# EAGLE design project (EAGLE 9.7.0)

## Sheet 1 of 2
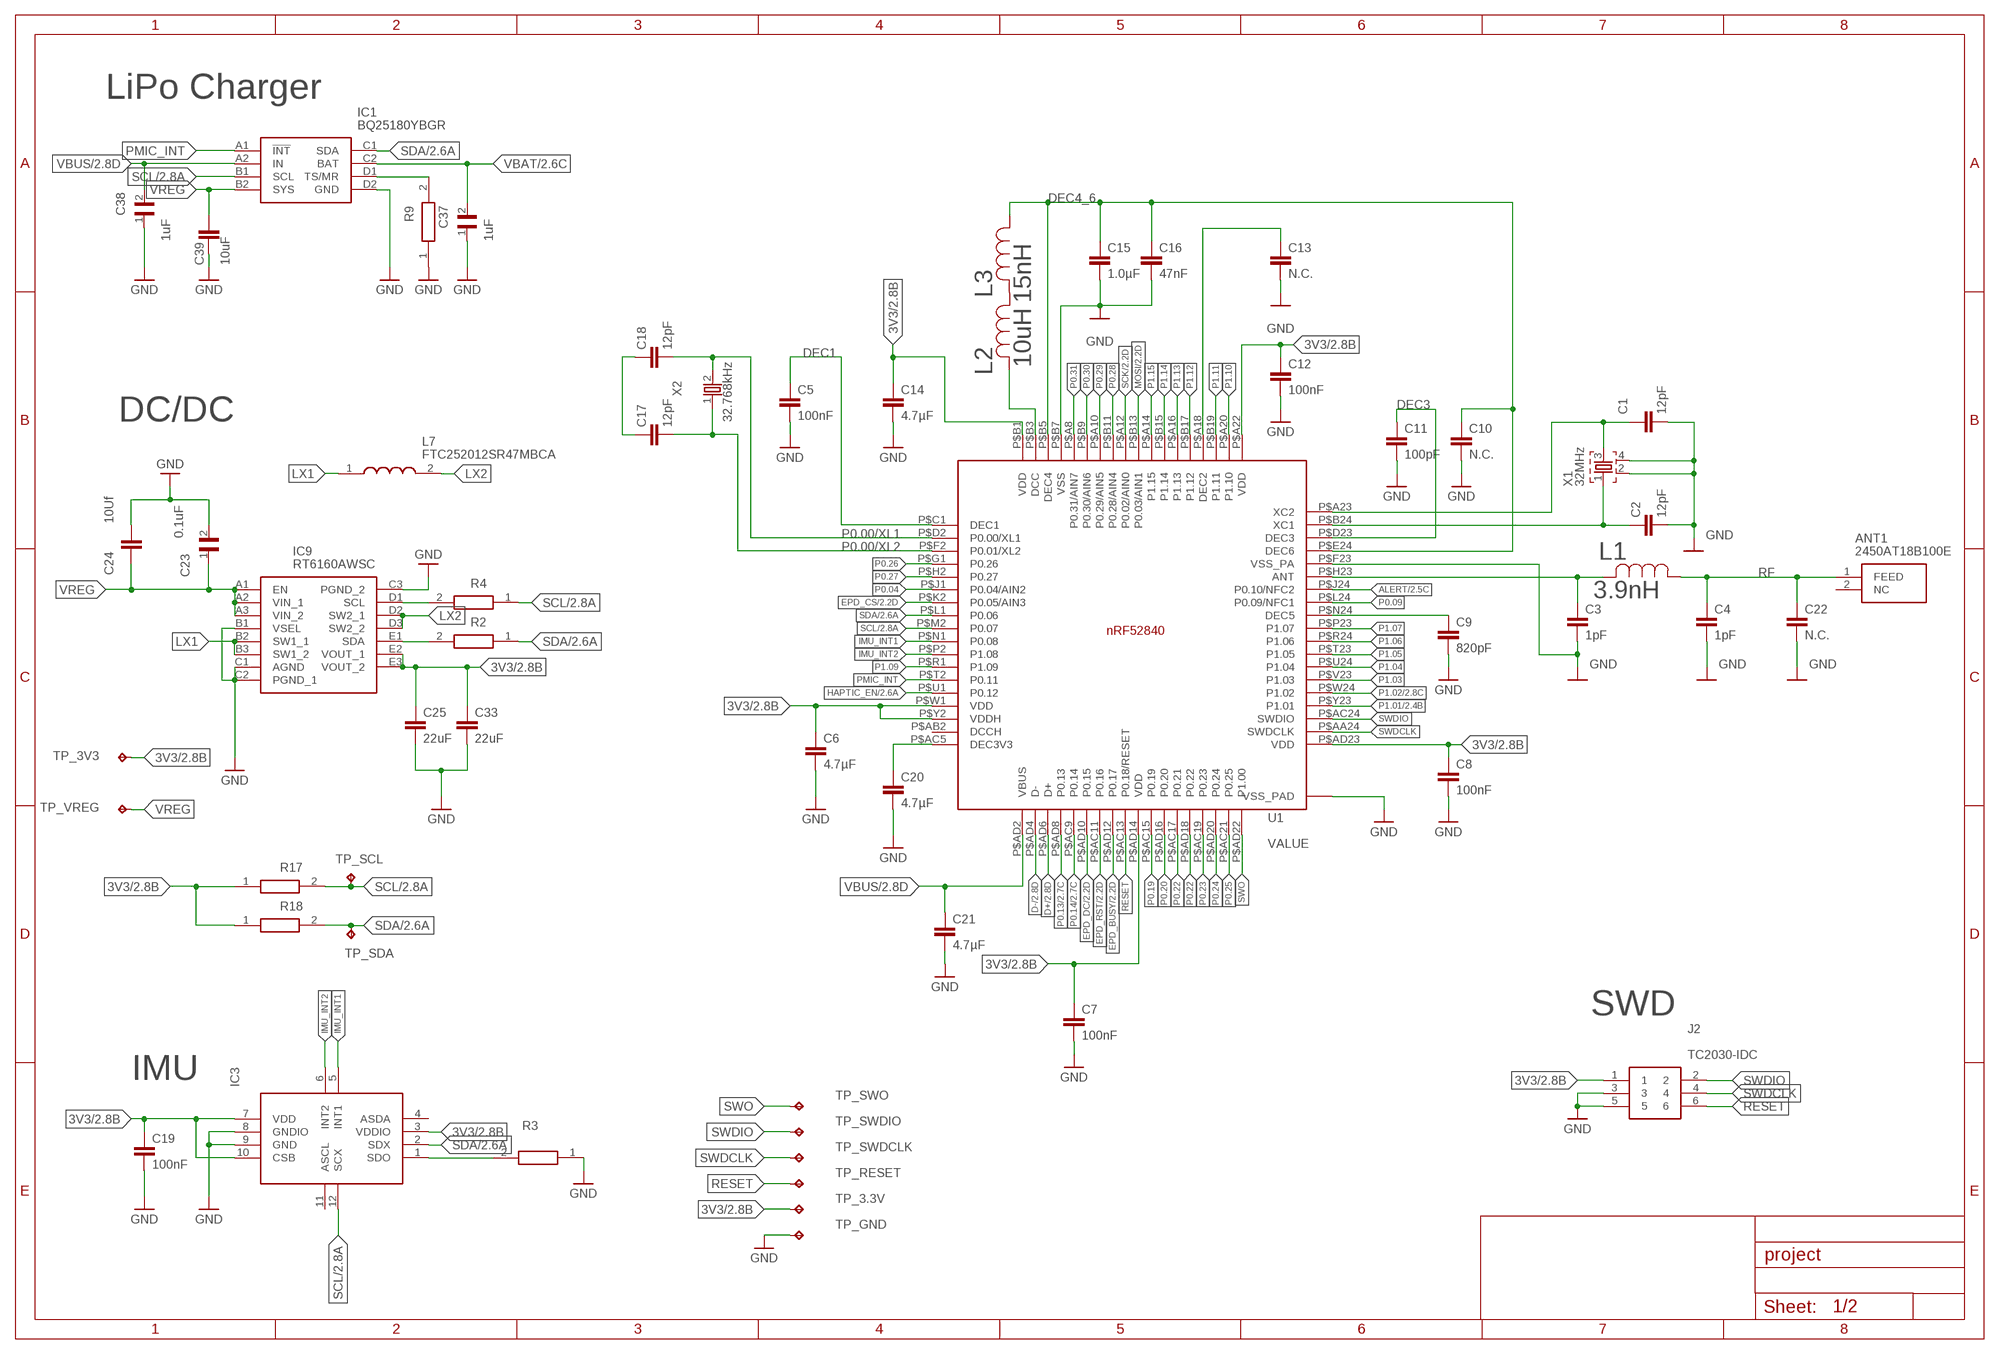
[diagram p0: schematic, sheet 1]

### Parts
ANT1  2450AT18B100E  2450AT18B100E_2450AT18B100E  [2450AT18B100E_ANTC3216X140N]
C1  12pF  PERFECT_0402_CAP_0402  [PERFECT_0402_0402]
C2  12pF  PERFECT_0402_CAP_0402  [PERFECT_0402_0402]
C3  1pF  PERFECT_0402_CAP_0402  [PERFECT_0402_0402]
C4  1pF  PERFECT_0402_CAP_0402  [PERFECT_0402_0402]
C5  100nF  PERFECT_0402_CAP_0402  [PERFECT_0402_0402]
C6  4.7µF  PERFECT_0402_CAP_0402  [PERFECT_0402_0402]
C7  100nF  PERFECT_0402_CAP_0402  [PERFECT_0402_0402]
C8  100nF  PERFECT_0402_CAP_0402  [PERFECT_0402_0402]
C9  820pF  PERFECT_0402_CAP_0402  [PERFECT_0402_0402]
C10  N.C.  PERFECT_0402_CAP_0402  [PERFECT_0402_0402]
C11  100pF  PERFECT_0402_CAP_0402  [PERFECT_0402_0402]
C12  100nF  PERFECT_0402_CAP_0402  [PERFECT_0402_0402]
C13  N.C.  PERFECT_0402_CAP_0402  [PERFECT_0402_0402]
C14  4.7µF  PERFECT_0402_CAP_0402  [PERFECT_0402_0402]
C15  1.0µF  PERFECT_0402_CAP_0402  [PERFECT_0402_0402]
C16  47nF  PERFECT_0402_CAP_0402  [PERFECT_0402_0402]
C17  12pF  PERFECT_0402_CAP_0402  [PERFECT_0402_0402]
C18  12pF  PERFECT_0402_CAP_0402  [PERFECT_0402_0402]
C19  100nF  PERFECT_0402_CAP_0402  [PERFECT_0402_0402]
C20  4.7µF  PERFECT_0402_CAP_0402  [PERFECT_0402_0402]
C21  4.7µF  PERFECT_0402_CAP_0402  [PERFECT_0402_0402]
C22  N.C.  PERFECT_0402_CAP_0402  [PERFECT_0402_0402]
C23  0.1uF  GRM011R60J152KE01L_1_GRM011R60J152KE01L  [GRM011R60J152KE01L_1_0201]
C24  10Uf  PERFECT_0402_CAP_0402  [PERFECT_0402_0402]
C25  22uF  PERFECT_0402_CAP_0402  [PERFECT_0402_0402]
C33  22uF  PERFECT_0402_CAP_0402  [PERFECT_0402_0402]
C37  1uF  GRM011R60J152KE01L_1_GRM011R60J152KE01L  [GRM011R60J152KE01L_1_0201]
C38  1uF  GRM011R60J152KE01L_1_GRM011R60J152KE01L  [GRM011R60J152KE01L_1_0201]
C39  10uF  PERFECT_0402_CAP_0402  [PERFECT_0402_0402]
IC1  BQ25180YBGR  BQ25180YBGR_BQ25180YBGR  [BQ25180YBGR_BGA8C40P2X4_100X155X50]
IC3  BMA421  BMA423_BMA423  [BMA423_BMA423]
IC9  RT6160AWSC  RT6160AWSC_RT6160AWSC  [RT6160AWSC_BGA15C40P3X5_140X230X60]
J2  TC2030-IDC  TC2030-IDC_TC2030-IDC  [TC2030-IDC_TC2030IDC]
L1  3.9nH  ESP32_C6_LIBRARY_2_744043680IND_4828-WE-TPC_WRE  [ESP32_C6_LIBRARY_2_IND_4828-WE-TPC_WRE]
L2  10uH  ESP32_C6_LIBRARY_2_744043680IND_4828-WE-TPC_WRE  [ESP32_C6_LIBRARY_2_IND_4828-WE-TPC_WRE]
L3  15nH  ESP32_C6_LIBRARY_2_744043680IND_4828-WE-TPC_WRE  [ESP32_C6_LIBRARY_2_IND_4828-WE-TPC_WRE]
L7  FTC252012SR47MBCA  MLP2016SR47MT0S1_FTC252012SR47MBCA  [MLP2016SR47MT0S1_INDC2016X100N]
R2  0  ERA-1AEB3401C_CPF0201D7K68C1  [ERA-1AEB3401C_0201]
R3  ERA-1AEB3401C_CPF0201D7K68C1  [ERA-1AEB3401C_0201]
R4  0  ERA-1AEB3401C_CPF0201D7K68C1  [ERA-1AEB3401C_0201]
R9  10K  ERA-1AEB3401C_CPF0201D7K68C1  [ERA-1AEB3401C_0201]
R17  3K3  ERA-1AEB3401C_CPF0201D7K68C1  [ERA-1AEB3401C_0201]
R18  3K3  ERA-1AEB3401C_CPF0201D7K68C1  [ERA-1AEB3401C_0201]
TP_3.3V  HECTOR_WATCH_1_TPTP20R  [HECTOR_WATCH_1_TP20R]
TP_3V3  HECTOR_WATCH_1_TPTP20R  [HECTOR_WATCH_1_TP20R]
TP_GND  HECTOR_WATCH_1_TPTP20R  [HECTOR_WATCH_1_TP20R]
TP_RESET  HECTOR_WATCH_1_TPTP20R  [HECTOR_WATCH_1_TP20R]
TP_SCL  HECTOR_WATCH_1_TPTP20R  [HECTOR_WATCH_1_TP20R]
TP_SDA  HECTOR_WATCH_1_TPTP20R  [HECTOR_WATCH_1_TP20R]
TP_SWDCLK  HECTOR_WATCH_1_TPTP20R  [HECTOR_WATCH_1_TP20R]
TP_SWDIO  HECTOR_WATCH_1_TPTP20R  [HECTOR_WATCH_1_TP20R]
TP_SWO  HECTOR_WATCH_1_TPTP20R  [HECTOR_WATCH_1_TP20R]
TP_VREG  HECTOR_WATCH_1_TPTP20R  [HECTOR_WATCH_1_TP20R]
U1  NRF52840_QF  NORDIC_NRF_4_NRF52840_QF  [NORDIC_NRF_4_AQFN50P700X700X85_HS-74N]
X1  32MHz  NORDIC_NRF_XTAL_32MHZ  [NORDIC_NRF_BT-XTAL_2016_N]
X2  32.768kHz  NORDIC_NRF_1_XTAL_32KHZ  [NORDIC_NRF_1_XTAL_3215_N]

### Nets
3V3: C6.1 C7.1 C8.1 C12.1 C14.1 C19.1 C25.1 C33.1 IC3.3(VDDIO) IC3.7(VDD) IC3.10(CSB) IC9.E2(VOUT_1) IC9.E3(VOUT_2) J2.1 R17.1 R18.1 TP_3.3V.TP TP_3V3.TP U1.P$A22(VDD) U1.P$AD14(VDD) U1.P$AD23(VDD) U1.P$B1(VDD) U1.P$W1(VDD) U1.P$Y2(VDDH) ; also sheet 2
ALERT: U1.P$J24(P0.10/NFC2) ; also sheet 2
D+: U1.P$AD6(D+) ; also sheet 2
D-: U1.P$AD4(D-) ; also sheet 2
DEC1: C5.1 U1.P$C1(DEC1)
DEC3: C11.1 U1.P$D23(DEC3)
DEC4_6: C10.1 C15.1 C16.1 L3.1 U1.P$B5(DEC4) U1.P$E24(DEC6)
EPD_BUSY: U1.P$AD12(P0.17) ; also sheet 2
EPD_CS: U1.P$K2(P0.05/AIN3) ; also sheet 2
EPD_DC: U1.P$AD10(P0.15) ; also sheet 2
EPD_RST: U1.P$AC11(P0.16) ; also sheet 2
GND: C1.2 C2.2 C3.2 C4.2 C5.2 C6.2 C7.2 C8.2 C9.2 C10.2 C11.2 C12.2 C13.2 C14.2 C15.2 C16.2 C19.2 C20.2 C21.2 C22.2 C23.2 C24.1 C25.2 C33.2 C37.1 C38.1 C39.2 IC1.D2(GND) IC3.8(GNDIO) IC3.9(GND) IC9.B1(VSEL) IC9.C1(AGND) IC9.C2(PGND_1) IC9.C3(PGND_2) J2.3 J2.5 R3.1 R9.1 TP_GND.TP U1.P$74(VSS_PAD) U1.P$75(VSS_PAD) U1.P$76(VSS_PAD) U1.P$77(VSS_PAD) U1.P$78(VSS_PAD) U1.P$79(VSS_PAD) U1.P$80(VSS_PAD) U1.P$81(VSS_PAD) U1.P$82(VSS_PAD) U1.P$83(VSS_PAD) U1.P$84(VSS_PAD) U1.P$85(VSS_PAD) U1.P$86(VSS_PAD) U1.P$87(VSS_PAD) U1.P$88(VSS_PAD) U1.P$89(VSS_PAD) U1.P$90(VSS_PAD) U1.P$B7(VSS) U1.P$F23(VSS_PA) X1.2 X1.4 ; also sheet 2
HAPTIC_EN: U1.P$U1(P0.12) ; also sheet 2
IMU_INT1: IC3.5(INT1) U1.P$N1(P0.08)
IMU_INT2: IC3.6(INT2) U1.P$P2(P1.08)
LX1: IC9.B2(SW1_1) IC9.B3(SW1_2) L7.1
LX2: IC9.D2(SW2_1) IC9.D3(SW2_2) L7.2
MOSI: U1.P$B13(P0.03/AIN1) ; also sheet 2
N$4: U1.P$AD18(P0.22)
N$18: C20.1 U1.P$AC5(DEC3V3)
N$58: C9.1 U1.P$N24(DEC5)
N$60: C17.1 C18.1
N$62: L2.2 U1.P$B3(DCC)
N$64: L2.1 L3.2
N$66: C13.1 U1.P$A18(DEC2)
N$68: C1.1 U1.P$A23(XC2) X1.3
N$69: C2.1 U1.P$B24(XC1) X1.1
N$71: C3.1 L1.2 U1.P$H23(ANT)
N$78: IC3.1(SDO) R3.2
N$89: IC1.D1(TS/MR) R9.2
N$99: IC9.D1(SCL) R4.2
N$100: IC9.E1(SDA) R2.2
P0.00/XL1: C18.2 U1.P$D2(P0.00/XL1) X2.2
P0.00/XL2: C17.2 U1.P$F2(P0.01/XL2) X2.1
P0.04: U1.P$J1(P0.04/AIN2)
P0.09: U1.P$L24(P0.09/NFC1)
P0.13: U1.P$AD8(P0.13) ; also sheet 2
P0.14: U1.P$AC9(P0.14) ; also sheet 2
P0.19: U1.P$AC15(P0.19)
P0.20: U1.P$AD16(P0.20)
P0.22: U1.P$AC17(P0.21)
P0.23: U1.P$AC19(P0.23)
P0.24: U1.P$AD20(P0.24)
P0.25: U1.P$AC21(P0.25)
P0.26: U1.P$G1(P0.26)
P0.27: U1.P$H2(P0.27)
P0.28: U1.P$B11(P0.28/AIN4)
P0.29: U1.P$A10(P0.29/AIN5)
P0.30: U1.P$B9(P0.30/AIN6)
P0.31: U1.P$A8(P0.31/AIN7)
P1.01: U1.P$Y23(P1.01) ; also sheet 2
P1.02: U1.P$W24(P1.02) ; also sheet 2
P1.03: U1.P$V23(P1.03)
P1.04: U1.P$U24(P1.04)
P1.05: U1.P$T23(P1.05)
P1.06: U1.P$R24(P1.06)
P1.07: U1.P$P23(P1.07)
P1.09: U1.P$R1(P1.09)
P1.10: U1.P$A20(P1.10)
P1.11: U1.P$B19(P1.11)
P1.12: U1.P$B17(P1.12)
P1.13: U1.P$A16(P1.13)
P1.14: U1.P$B15(P1.14)
P1.15: U1.P$A14(P1.15)
PMIC_INT: IC1.A1(!INT) U1.P$T2(P0.11)
RESET: J2.6 TP_RESET.TP U1.P$AC13(P0.18/RESET)
RF: ANT1.1(FEED) C4.1 C22.1 L1.1
SCK: U1.P$A12(P0.02/AIN0) ; also sheet 2
SCL: IC1.B1(SCL) IC3.12(SCX) R4.1 R17.2 TP_SCL.TP U1.P$M2(P0.07) ; also sheet 2
SDA: IC1.C1(SDA) IC3.2(SDX) R2.1 R18.2 TP_SDA.TP U1.P$L1(P0.06) ; also sheet 2
SWDCLK: J2.4 TP_SWDCLK.TP U1.P$AA24(SWDCLK)
SWDIO: J2.2 TP_SWDIO.TP U1.P$AC24(SWDIO)
SWO: TP_SWO.TP U1.P$AD22(P1.00)
VBAT: C37.2 IC1.C2(BAT) ; also sheet 2
VBUS: C21.1 C38.2 IC1.A2(IN) U1.P$AD2(VBUS) ; also sheet 2
VREG: C23.1 C24.2 C39.1 IC1.B2(SYS) IC9.A1(EN) IC9.A2(VIN_1) IC9.A3(VIN_2) TP_VREG.TP
Unconnected: ANT1.2(NC) IC3.4(ASDA) IC3.11(ASCL) U1.P$AB2(DCCH)

### Notes on the sheet
- LiPo Charger
- DC/DC
- SWD
- IMU

## Sheet 2 of 2
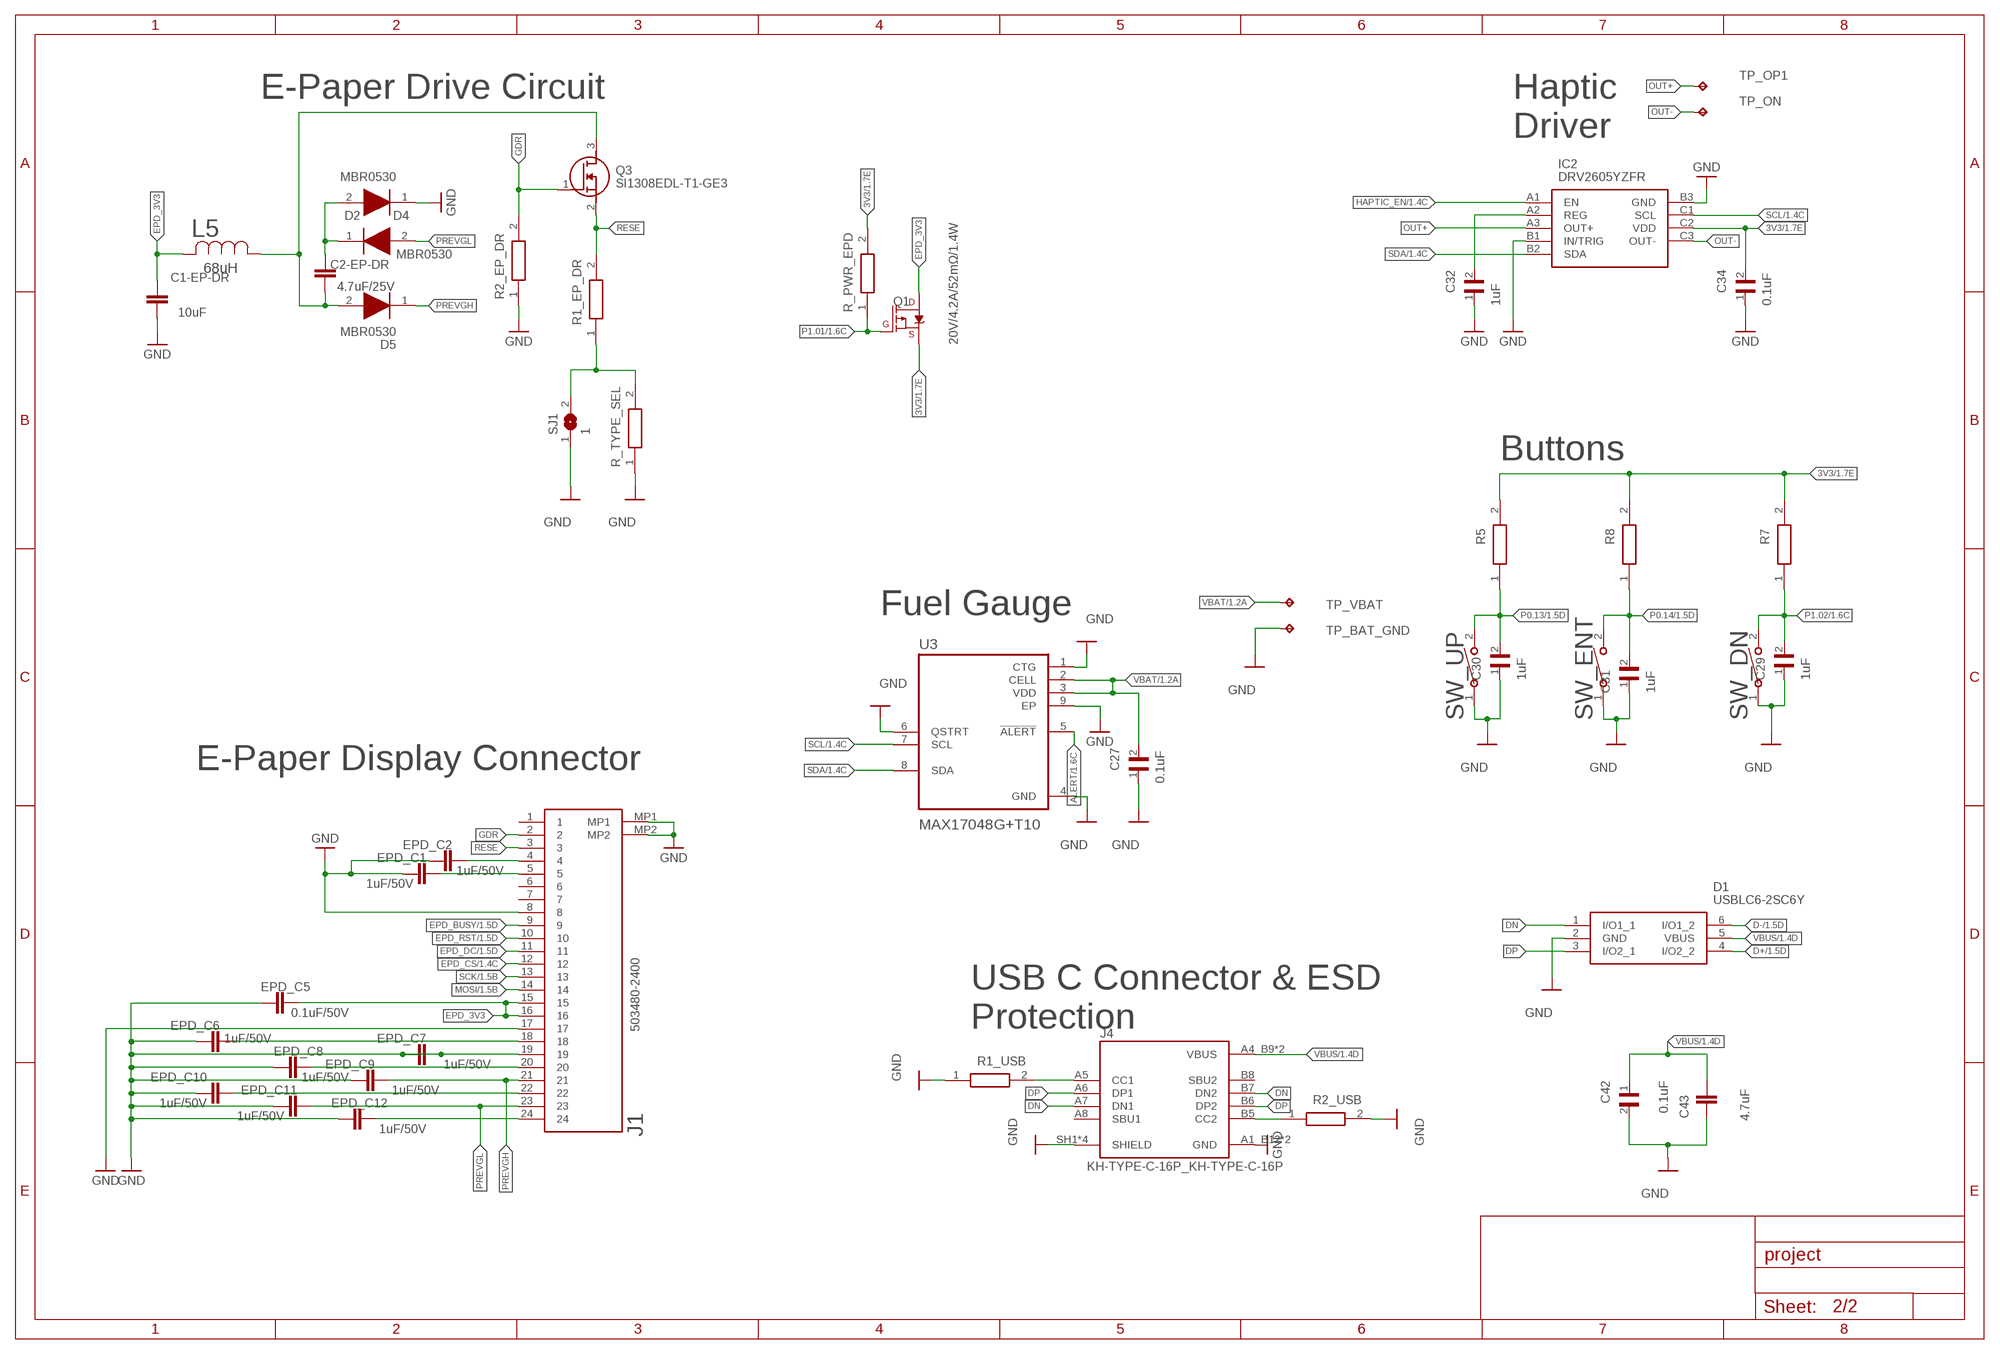
[diagram p1: schematic, sheet 2]

### Parts
C1-EP-DR  10uF  ESP32_C6_LIBRARY_1_ESP32_WROVER_EAGLE-LTSPICE_CC0402  [ESP32_C6_LIBRARY_1_ESP32_WROVER_EAGLE-LTSPICE_C0402]
C2-EP-DR  4.7uF/25V  ESP32_C6_LIBRARY_1_ESP32_WROVER_EAGLE-LTSPICE_CC0402  [ESP32_C6_LIBRARY_1_ESP32_WROVER_EAGLE-LTSPICE_C0402]
C27  0.1uF  GRM011R60J152KE01L_1_GRM011R60J152KE01L  [GRM011R60J152KE01L_1_0201]
C29  1uF  GRM011R60J152KE01L_1_GRM011R60J152KE01L  [GRM011R60J152KE01L_1_0201]
C30  1uF  GRM011R60J152KE01L_1_GRM011R60J152KE01L  [GRM011R60J152KE01L_1_0201]
C31  1uF  GRM011R60J152KE01L_1_GRM011R60J152KE01L  [GRM011R60J152KE01L_1_0201]
C32  1uF  GRM011R60J152KE01L_1_GRM011R60J152KE01L  [GRM011R60J152KE01L_1_0201]
C34  0.1uF  GRM011R60J152KE01L_1_GRM011R60J152KE01L  [GRM011R60J152KE01L_1_0201]
C42  0.1uF  GRM011R60J152KE01L_1_GRM011R60J152KE01L  [GRM011R60J152KE01L_1_0201]
C43  4.7uF  ESP32_C6_LIBRARY_1_ESP32_WROVER_EAGLE-LTSPICE_CC0402  [ESP32_C6_LIBRARY_1_ESP32_WROVER_EAGLE-LTSPICE_C0402]
D1  USBLC6-2SC6Y  ESP32_C6_LIBRARY_3_USBLC6-2SC6Y  [ESP32_C6_LIBRARY_3_SOT95P280X145-6N]
D2  MBR0530  ESP32_C6_LIBRARY_5_MBR0530  [ESP32_C6_LIBRARY_5_SOD3716X135N]
D4  MBR0530  ESP32_C6_LIBRARY_5_MBR0530  [ESP32_C6_LIBRARY_5_SOD3716X135N]
D5  MBR0530  ESP32_C6_LIBRARY_5_MBR0530  [ESP32_C6_LIBRARY_5_SOD3716X135N]
EPD_C1  1uF/50V  ESP32_C6_LIBRARY_1_ESP32_WROVER_EAGLE-LTSPICE_CC0402  [ESP32_C6_LIBRARY_1_ESP32_WROVER_EAGLE-LTSPICE_C0402]
EPD_C2  1uF/50V  ESP32_C6_LIBRARY_1_ESP32_WROVER_EAGLE-LTSPICE_CC0402  [ESP32_C6_LIBRARY_1_ESP32_WROVER_EAGLE-LTSPICE_C0402]
EPD_C5  0.1uF/50V  ESP32_C6_LIBRARY_1_ESP32_WROVER_EAGLE-LTSPICE_CC0402  [ESP32_C6_LIBRARY_1_ESP32_WROVER_EAGLE-LTSPICE_C0402]
EPD_C6  1uF/50V  ESP32_C6_LIBRARY_1_ESP32_WROVER_EAGLE-LTSPICE_CC0402  [ESP32_C6_LIBRARY_1_ESP32_WROVER_EAGLE-LTSPICE_C0402]
EPD_C7  1uF/50V  ESP32_C6_LIBRARY_1_ESP32_WROVER_EAGLE-LTSPICE_CC0402  [ESP32_C6_LIBRARY_1_ESP32_WROVER_EAGLE-LTSPICE_C0402]
EPD_C8  1uF/50V  ESP32_C6_LIBRARY_1_ESP32_WROVER_EAGLE-LTSPICE_CC0402  [ESP32_C6_LIBRARY_1_ESP32_WROVER_EAGLE-LTSPICE_C0402]
EPD_C9  1uF/50V  ESP32_C6_LIBRARY_1_ESP32_WROVER_EAGLE-LTSPICE_CC0402  [ESP32_C6_LIBRARY_1_ESP32_WROVER_EAGLE-LTSPICE_C0402]
EPD_C10  1uF/50V  ESP32_C6_LIBRARY_1_ESP32_WROVER_EAGLE-LTSPICE_CC0402  [ESP32_C6_LIBRARY_1_ESP32_WROVER_EAGLE-LTSPICE_C0402]
EPD_C11  1uF/50V  ESP32_C6_LIBRARY_1_ESP32_WROVER_EAGLE-LTSPICE_CC0402  [ESP32_C6_LIBRARY_1_ESP32_WROVER_EAGLE-LTSPICE_C0402]
EPD_C12  1uF/50V  ESP32_C6_LIBRARY_1_ESP32_WROVER_EAGLE-LTSPICE_CC0402  [ESP32_C6_LIBRARY_1_ESP32_WROVER_EAGLE-LTSPICE_C0402]
IC2  DRV2605YZFR  DRV2605YZFR_DRV2605YZFR  [DRV2605YZFR_BGA9C50P3X3_144X144X62]
J1  503480-2400  503480-2400_503480-2400  [503480-2400_5034802400]
J4  KH-TYPE-C-16P_KH-TYPE-C-16P  [KH-TYPE-C-16P_KINGHELM_KH-TYPE-C-16P]
L5  68uH  ESP32_C6_LIBRARY_2_744043680IND_4828-WE-TPC_WRE  [ESP32_C6_LIBRARY_2_IND_4828-WE-TPC_WRE]
Q1  20V/4.2A/52mΩ/1.4W  ESP32_C6_LIBRARY_4_ESP32_WROVER_SPARKFUN-DISCRETESEMI_MOSFET_PCH-DMG2305UX-7  [ESP32_C6_LIBRARY_4_ESP32_C6_LIBRARY_4_ESP32_C6_LIBRARY_4_ESP32_C6_LIBRARY_4_ESP32_WROVER_SPARKFUN-DISCRETESEMI_SOT23-3]
Q3  SI1308EDL-T1-GE3  ESP32_C6_LIBRARY_6_SI1308EDL-T1-GE3  [ESP32_C6_LIBRARY_6_SOT65P210X110-3N]
R1_EP_DR  0.47  ERA-1AEB3401C_CPF0201D7K68C1  [ERA-1AEB3401C_0201]
R1_USB  5k1  ERA-1AEB3401C_CPF0201D7K68C1  [ERA-1AEB3401C_0201]
R2_EP_DR  10K  ERA-1AEB3401C_CPF0201D7K68C1  [ERA-1AEB3401C_0201]
R2_USB  5k1  ERA-1AEB3401C_CPF0201D7K68C1  [ERA-1AEB3401C_0201]
R5  10K  ERA-1AEB3401C_CPF0201D7K68C1  [ERA-1AEB3401C_0201]
R7  10K  ERA-1AEB3401C_CPF0201D7K68C1  [ERA-1AEB3401C_0201]
R8  10K  ERA-1AEB3401C_CPF0201D7K68C1  [ERA-1AEB3401C_0201]
R_PWR_EPD  10K  ERA-1AEB3401C_CPF0201D7K68C1  [ERA-1AEB3401C_0201]
R_TYPE_SEL  2.2  ERA-1AEB3401C_CPF0201D7K68C1  [ERA-1AEB3401C_0201]
SJ1  1  ESP32_C6_LIBRARY_7_JUMPER_SJ  [ESP32_C6_LIBRARY_7_JUMPER_SJ]
SW_DN  2025-10-22_07-23-44_LIBRARY_EVP-AKE31ASW_EVP-AKE31A_PAN  [2025-10-22_07-23-44_LIBRARY_SW_EVP-AKE31A_PAN]
SW_ENT  2025-10-22_07-23-44_LIBRARY_EVP-AKE31ASW_EVP-AKE31A_PAN  [2025-10-22_07-23-44_LIBRARY_SW_EVP-AKE31A_PAN]
SW_UP  SW_UP  2025-10-22_07-23-44_LIBRARY_EVP-AKE31ASW_EVP-AKE31A_PAN  [2025-10-22_07-23-44_LIBRARY_SW_EVP-AKE31A_PAN]
TP_BAT_GND  HECTOR_WATCH_1_TPTP20R  [HECTOR_WATCH_1_TP20R]
TP_ON  HECTOR_WATCH_1_TPTP20R  [HECTOR_WATCH_1_TP20R]
TP_OP1  HECTOR_WATCH_1_TPTP20R  [HECTOR_WATCH_1_TP20R]
TP_VBAT  3V3  HECTOR_WATCH_1_TPTP20R  [HECTOR_WATCH_1_TP20R]
U3  MAX17048G+T10  ESP32_C6_LIBRARY_MAX17048G+T10  [ESP32_C6_LIBRARY_SON50P200X200X80-9N]

### Nets
3V3: C34.2 IC2.C2(VDD) Q1.2(S) R5.2 R7.2 R8.2 R_PWR_EPD.2 ; also sheet 1
ALERT: U3.5(!ALERT) ; also sheet 1
D+: D1.4(I/O2_2) ; also sheet 1
D-: D1.6(I/O1_2) ; also sheet 1
DN: D1.1(I/O1_1) J4.A7(DN1) J4.B7(DN2)
DP: D1.3(I/O2_1) J4.A6(DP1) J4.B6(DP2)
EPD_3V3: C1-EP-DR.2 EPD_C5.2 J1.15 J1.16 L5.2 Q1.3(D)
EPD_BUSY: J1.9 ; also sheet 1
EPD_CS: J1.12 ; also sheet 1
EPD_DC: J1.11 ; also sheet 1
EPD_RST: J1.10 ; also sheet 1
GDR: J1.2 Q3.1(G) R2_EP_DR.2
GND: C1-EP-DR.1 C27.1 C29.1 C30.1 C31.1 C32.1 C34.1 C42.2 C43.1 D1.2(GND) D4.1(K) EPD_C1.1 EPD_C2.1 EPD_C5.1 EPD_C6.1 EPD_C7.1 EPD_C7.2 EPD_C8.1 EPD_C9.1 EPD_C10.1 EPD_C11.1 EPD_C12.1 IC2.B1(IN/TRIG) IC2.B3(GND) J1.8 J1.17 J1.19 J1.MP1 J1.MP2 J4.A1_B12(GND) J4.A12_B1(GND) J4.SH1(SHIELD) J4.SH2(SHIELD) J4.SH3(SHIELD) J4.SH4(SHIELD) R1_USB.1 R2_EP_DR.1 R2_USB.2 R_TYPE_SEL.1 SJ1.1 SW_DN.1 SW_ENT.1 SW_UP.1 TP_BAT_GND.TP U3.1(CTG) U3.4(GND) U3.6(QSTRT) U3.9(EP) ; also sheet 1
HAPTIC_EN: IC2.A1(EN) ; also sheet 1
MOSI: J1.14 ; also sheet 1
N$33: EPD_C2.2 J1.4
N$70: EPD_C6.2 J1.18
N$72: EPD_C1.2 J1.5
N$109: EPD_C8.2 J1.20
N$111: EPD_C10.2 J1.22
N$113: EPD_C12.2 J1.24
N$121: C2-EP-DR.1 D5.2(A) L5.1 Q3.3(D)
N$122: C2-EP-DR.2 D2.1(K) D4.2(A)
N$127: R1_EP_DR.1 R_TYPE_SEL.2 SJ1.2
N$140: C32.2 IC2.A2(REG)
N$162: J4.A5(CC1) R1_USB.2
N$163: J4.B5(CC2) R2_USB.1
OUT+: IC2.A3(OUT+) TP_OP1.TP
OUT-: IC2.C3(OUT-) TP_ON.TP
P0.13: C30.2 R5.1 SW_UP.2 ; also sheet 1
P0.14: C31.2 R8.1 SW_ENT.2 ; also sheet 1
P1.01: Q1.1(G) R_PWR_EPD.1 ; also sheet 1
P1.02: C29.2 R7.1 SW_DN.2 ; also sheet 1
PREVGH: D5.1(K) EPD_C9.2 J1.21
PREVGL: D2.2(A) EPD_C11.2 J1.23
RESE: J1.3 Q3.2(S) R1_EP_DR.2
SCK: J1.13 ; also sheet 1
SCL: IC2.C1(SCL) U3.7(SCL) ; also sheet 1
SDA: IC2.B2(SDA) U3.8(SDA) ; also sheet 1
VBAT: C27.2 TP_VBAT.TP U3.2(CELL) U3.3(VDD) ; also sheet 1
VBUS: C42.1 C43.2 D1.5(VBUS) J4.A4_B9(VBUS) J4.A9_B4(VBUS) ; also sheet 1
Unconnected: J1.1 J1.6 J1.7 J4.A8(SBU1) J4.B8(SBU2)

### Notes on the sheet
- E-Paper Drive Circuit
- Haptic
  Driver
- Buttons
- Fuel Gauge
- E-Paper Display Connector
- USB C Connector & ESD
  Protection

## Library data of the parts
ANT1 = InkTime_v5:2450AT18B100E_2450AT18B100E: Antennas 2.45GHz ANTENNA Source: Datasheet <https://www.johansontechnology.com/datasheets/2450AT18B100/2450AT18B100.pdf>; ARROW_PART_NUMBER: 2450AT18B100E; ARROW_PRICE-STOCK: https://www.arrow.com/en/products/2450at18b100e/johanson-dielectrics?utm_currency=USD&region=nac; DESCRIPTION: Antennas 2.45GHz ANTENNA; HEIGHT: 1.4mm; MANUFACTURER_NAME: JOHANSON TECHNOLOGY; MANUFACTURER_PART_NUMBER: 2450AT18B100E; MOUSER_PART_NUMBER: 609-2450AT18B100E; MOUSER_PRICE-STOCK: https://www.mouser.co.uk/ProductDetail/Johanson-Technology/2450AT18B100E?qs=yCnrNFeXz%252Bh5MFsFIXGZGA%3D%3D
C1-C22 C24 C25 C33 C39 = InkTime_v5:PERFECT_0402_CAP_0402: 0402 (1005 Metric) Nick Garner - TeleSense
C1-EP-DR C2-EP-DR C43 EPD_C1 EPD_C2 EPD_C5-EPD_C12 = InkTime_v5:ESP32_C6_LIBRARY_1_ESP32_WROVER_EAGLE-LTSPICE_C: CAPACITOR, European symbol; SPICEMODEL: NONE; SPICEPREFIX: C
C23 C27 C29-C32 C34 C37 C38 C42 = InkTime_v5:GRM011R60J152KE01L_1_GRM011R60J152KE01L: Check availability <https://pricing.snapeda.com/parts/GRM011R60J152KE01L/Murata/view-part?ref=eda>
D1 = InkTime_v5:ESP32_C6_LIBRARY_3_USBLC6-2SC6Y: Low Cap. ESD Protection Auto SOT-23-6 STMicroelectronics USBLC6-2SC6Y, Dual Uni-Directional TVS Diode Array, 6-Pin SOT-23 Source: Datasheet <https://componentsearchengine.com/Datasheets/1/USBLC6-2SC6Y.pdf> Check availability <https://pricing.snapeda.com/parts/USBLC6-2SC6Y/STMicroelectronics/view-part?ref=eda>; AVAILABILITY: In Stock; CHECK_PRICES: https://www.snapeda.com/parts/USBLC6-2SC6Y/STMicroelectronics/view-part/?ref=eda; DESCRIPTION: 17V Clamp 5A (8/20µs) Ipp Tvs Diode Surface Mount SOT-23-6; MF: STMicroelectronics; MP: USBLC6-2SC6Y; PACKAGE: SOT-23-6 STMicroelectronics; PRICE: None; SNAPEDA_LINK: https://www.snapeda.com/parts/USBLC6-2SC6Y/STMicroelectronics/view-part/?ref=snap
D2 D4 D5 = InkTime_v5:ESP32_C6_LIBRARY_5_MBR0530: ON SEMICONDUCTOR - MBR0530 - DIODE, SCHOTTKY, 0.5A, 30V, SOD-123 Source: Datasheet <http://www.onsemi.com/pub/Collateral/MBR0530T1-D.PDF> Check availability <https://pricing.snapeda.com/parts/MBR0530/ON%20Semiconductor/view-part?ref=eda>; AVAILABILITY: In Stock; CHECK_PRICES: https://www.snapeda.com/parts/MBR0530/Onsemi/view-part/?ref=eda; DESCRIPTION: Diode Schottky 30 V 500mA Surface Mount SOD-123; MF: ON Semiconductor; MP: MBR0530; PACKAGE: SOD-123-2 ON Semiconductor; PRICE: None; PURCHASE-URL: https://www.snapeda.com/api/url_track_click_mouser/?unipart_id=179458&manufacturer=ON Semiconductor&part_name=MBR0530&search_term=None; SNAPEDA_LINK: https://www.snapeda.com/parts/MBR0530/Onsemi/view-part/?ref=snap
IC1 = InkTime_v5:BQ25180YBGR_BQ25180YBGR: Charger IC Lithium Ion/Polymer, Lithium Iron Phosphate 8-DSBGA (1.6x1.1) Source: Datasheet <https://www.ti.com/lit/ds/symlink/bq25180.pdf?ts=1650264094470&ref_url=https%3A%2F%2Fwww.ti.com%2Fproduct%2FBQ25180>; ARROW_PART_NUMBER: BQ25180YBGR; ARROW_PRICE-STOCK: https://www.arrow.com/en/products/bq25180ybgr/texas-instruments?utm_currency=USD&region=nac; DESCRIPTION: Charger IC Lithium Ion/Polymer, Lithium Iron Phosphate 8-DSBGA (1.6x1.1); HEIGHT: 0.5mm; MANUFACTURER_NAME: Texas Instruments; MANUFACTURER_PART_NUMBER: BQ25180YBGR; MOUSER_PART_NUMBER: 595-BQ25180YBGR; MOUSER_PRICE-STOCK: https://www.mouser.co.uk/ProductDetail/Texas-Instruments/BQ25180YBGR?qs=doiCPypUmgEWjAK%252BJAX6Tw%3D%3D
IC2 = InkTime_v5:DRV2605YZFR_DRV2605YZFR: Haptic Driver for ERM/LRA with Built-In Library and Smart Loop Architecture Source: Datasheet <http://www.ti.com/lit/gpn/drv2605>; ARROW_PART_NUMBER: DRV2605YZFR; ARROW_PRICE-STOCK: https://www.arrow.com/en/products/drv2605yzfr/texas-instruments?region=nac; DESCRIPTION: Haptic Driver for ERM/LRA with Built-In Library and Smart Loop Architecture; HEIGHT: 0.625mm; MANUFACTURER_NAME: Texas Instruments; MANUFACTURER_PART_NUMBER: DRV2605YZFR
IC3 = InkTime_v5:BMA423_BMA423: Accelerometers Triaxial low-g 12bit Acceleration Sensor Source: Datasheet <https://www.mouser.com/datasheet/2/783/BST-BMA423-DS000-1509600.pdf>; ARROW_PART_NUMBER: BMA423; ARROW_PRICE-STOCK: https://www.arrow.com/en/products/bma423/bosch; DESCRIPTION: Accelerometers Triaxial low-g 12bit Acceleration Sensor; HEIGHT: 1mm; MANUFACTURER_NAME: BOSCH; MANUFACTURER_PART_NUMBER: BMA423; MOUSER_PART_NUMBER: 262-BMA423; MOUSER_PRICE-STOCK: https://www.mouser.co.uk/ProductDetail/Bosch-Sensortec/BMA423?qs=HXFqYaX1Q2xC%252BSgeGoX3mg%3D%3D
IC9 = InkTime_v5:RT6160AWSC_RT6160AWSC: Buck-Boost Regulator Positive Output Step-Up/Step-Down I2C DC-DC Controller IC 15-WL-CSP (BSC) (1.4x2.3) Source: Datasheet <https://www.richtek.com/SaveDownload.aspx?specid=RT6160A>; DESCRIPTION: Buck-Boost Regulator Positive Output Step-Up/Step-Down I2C DC-DC Controller IC 15-WL-CSP (BSC) (1.4x2.3); HEIGHT: 0.6mm; MANUFACTURER_NAME: RICHTEK; MANUFACTURER_PART_NUMBER: RT6160AWSC; MOUSER_PART_NUMBER: 835-RT6160AWSC; MOUSER_PRICE-STOCK: https://www.mouser.co.uk/ProductDetail/Richtek/RT6160AWSC?qs=amGC7iS6iy%2FLd9PSoixZXQ%3D%3D
J1 = InkTime_v5:503480-2400_503480-2400: FFC & FPC Connectors 0.5mm FPC RA SMT Dual Contact 24Ckt Source: Datasheet <https://componentsearchengine.com/Datasheets/1/503480-2400.pdf>; DESCRIPTION: FFC & FPC Connectors 0.5mm FPC RA SMT Dual Contact 24Ckt; HEIGHT: 1.87mm; MANUFACTURER_NAME: Molex; MANUFACTURER_PART_NUMBER: 503480-2400; MOUSER_PART_NUMBER: 538-503480-2400; MOUSER_PRICE-STOCK: https://www.mouser.co.uk/ProductDetail/Molex/503480-2400?qs=OAhjpuo3Vu7efIoxFh9AOw%3D%3D
J2 = InkTime_v5:TC2030-IDC_TC2030-IDC: CABLE ADAPTER 6 POS Source: Datasheet <https://datasheet.datasheetarchive.com/originals/distributors/Datasheets_SAMA/62bc384e093448baaaa63dbd0b9d8707.pdf>; DESCRIPTION: CABLE ADAPTER 6 POS; HEIGHT: 19mm; MANUFACTURER_NAME: Tag Connect; MANUFACTURER_PART_NUMBER: TC2030-IDC
J4 = InkTime_v5:KH-TYPE-C-16P_KH-TYPE-C-16P: Check availability <https://pricing.snapeda.com/parts/KH-TYPE-C-16P/kinghelm/view-part?ref=eda>; AVAILABILITY: Not in stock; CHECK_PRICES: https://www.snapeda.com/parts/KH-TYPE-C-16P/Kinghelm/view-part/?ref=eda; MF: kinghelm; MP: KH-TYPE-C-16P; PACKAGE: None; PRICE: None; SNAPEDA_LINK: https://www.snapeda.com/parts/KH-TYPE-C-16P/Kinghelm/view-part/?ref=snap
L1-L3 L5 = InkTime_v5:ESP32_C6_LIBRARY_2_744043680; COPYRIGHT: Copyright (C) 2024 Ultra Librarian. All rights reserved.; MANUFACTURER_PART_NUMBER: 744043680; MFR_NAME: Wurth Electronics
L7 = InkTime_v5:MLP2016SR47MT0S1_FTC252012SR47MBCA: SMD / SMT Inductors (Coils), L=0.47?H, L x W x T : Source: Datasheet <https://product.tdk.com/system/files/dam/doc/product/inductor/inductor/smd/catalog/inductor_commercial_power_mlp2016_en.pdf>; DESCRIPTION: SMD / SMT Inductors (Coils), L=0.47?H, L x W x T :; HEIGHT: 1mm; JLCPCB: https://jlcpcb.com/partdetail/6763488-FTC252012SR47MBCA/C5832368; MANUFACTURER_NAME: TDK; MANUFACTURER_PART_NUMBER: FTC252012SR47MBCA
Q1 = InkTime_v5:ESP32_C6_LIBRARY_4_ESP32_WROVER_SPARKFUN-DISCRETESEMI_MOSFET_PCH: P-channel MOSFETs Voltage controlled devices that allow control of high current outputs. SparkFun Products: SparkFun ESP32 Thing <https://www.sparkfun.com/products/13907> SparkFun ESP8266 Thing <https://www.sparkfun.com/products/13231> SparkFun Pi Servo HAT V2 <https://www.sparkfun.com/products/15316> DMG2305UX-7 (20V/4.2A/SOT23-3); PROD_ID: TRAN-14388
Q3 = InkTime_v5:ESP32_C6_LIBRARY_6_SI1308EDL-T1-GE3: MOSFET N-Ch 30V 1.5A TrenchFET SC70 Vishay Si1308EDL-T1-GE3 N-channel MOSFET Transistor, 1.5 A, 30 V, 3-Pin SC-70 Source: Datasheet <https://componentsearchengine.com/Datasheets/1/SI1308EDL-T1-GE3.pdf> Check availability <https://pricing.snapeda.com/parts/SI1308EDL-T1-GE3/Vishay%20Siliconix/view-part?ref=eda>; AVAILABILITY: In Stock; CHECK_PRICES: https://www.snapeda.com/parts/SI1308EDL-T1-GE3/Vishay+Siliconix/view-part/?ref=eda; DESCRIPTION: Si1308EDL-T1-GE3 N-channel MOSFET Transistor, 1.5 A, 30 V, 3-Pin SC-70 | Siliconix / Vishay SI1308EDL-T1-GE3; MF: Vishay Siliconix; MP: SI1308EDL-T1-GE3; PACKAGE: SOT-323 Vishay Semiconductor; PRICE: None; PURCHASE-URL: https://www.snapeda.com/api/url_track_click_mouser/?unipart_id=274603&manufacturer=Vishay Siliconix&part_name=SI1308EDL-T1-GE3&search_term=None; SNAPEDA_LINK: https://www.snapeda.com/parts/SI1308EDL-T1-GE3/Vishay+Siliconix/view-part/?ref=snap
R1_EP_DR R1_USB R2 R2_EP_DR R2_USB R3-R5 R7-R9 R17 R18 R_PWR_EPD R_TYPE_SEL = InkTime_v5:ERA-1AEB3401C_CPF0201D7K68C1: 7.68k 0201 Thin Film Surface Mount Fixed Resistor +/-0.5% 0.031W CPF0201D7K68C1 Source: Datasheet <http://www.te.com/commerce/DocumentDelivery/DDEController?Action=showdoc&DocId=Data Sheet1773200-1ApdfEnglishENG_DS_1773200-1_A.pdf4-2176215-6>
SJ1 = InkTime_v5:ESP32_C6_LIBRARY_7_JUMPER_SJ: SMD solder JUMPER
SW_DN SW_ENT SW_UP = InkTime_v5:2025-10-22_07-23-44_LIBRARY_EVP-AKE31A; COPYRIGHT: Copyright (C) 2025 Ultra Librarian. All rights reserved.; DIGI-KEY_PART_NUMBER_1: P123437TR-ND; DIGI-KEY_PART_NUMBER_2: P123437CT-ND; DIGI-KEY_PART_NUMBER_3: P123437DKR-ND; MANUFACTURER_NAME: Panasonic; MANUFACTURER_PART_NUMBER: EVP-AKE31A
TP_3.3V TP_3V3 TP_BAT_GND TP_GND TP_ON TP_OP1 TP_RESET TP_SCL TP_SDA TP_SWDCLK TP_SWDIO TP_SWO TP_VBAT TP_VREG = InkTime_v5:HECTOR_WATCH_1_TP: Test pad
U1 = InkTime_v5:NORDIC_NRF_4_NRF52840_QF: nRF52840 Features Advanced Single chip 2.4 GHz multi-protocol SoC 32-bit ARM Cortex-M4F Processor 1.7v to 5.5v operation 1MB flash + 256kB RAM Bluetooth 5 support for long range and high throughput 802.15.4 radio support On-chip NFC PPI –Programmable Peripheral Interconnect Automated power management system with automatic power management of each peripheral Configurable I/O mapping for analog and digital I/O 48 x GPIO 1 x QSPI 4 x Master/Slave SPI 2 x Two-wire interface (I²C) I²S interface 2 x UART 4 x PWM USB 2.0 controller ARM TrustZone CryptoCell-310 Cryptographic and security module AES 128-bit ECB/CCM/AAR hardware accelerator Digital microphone interface (PDM) Quadrature decoder 12-bit ADC Low power comparator On-chip 50Ω balun On-air compatible with nRF52, nRF51 and nRF24 Series Applications Advanced high performance wearables Wearables for secure payments Virtual Reality/Augmented Reality systems Smart Home sensor networks Smart city sensor networks High performance HID controllers Internet of Things (IoT) sensor networks Smart door locks Smart lighting networks Connected white goods
U3 = InkTime_v5:ESP32_C6_LIBRARY_MAX17048G+T10: Check availability <https://pricing.snapeda.com/parts/MAX17048G%2BT10/Analog%20Devices/view-part?ref=eda>; AVAILABILITY: In Stock; CHECK_PRICES: https://www.snapeda.com/parts/MAX17048G+T10/Analog+Devices/view-part/?ref=eda; DESCRIPTION: 3µA 1-Cell/2-Cell Fuel Gauge with ModelGauge; MF: Analog Devices; MP: MAX17048G+T10; PACKAGE: TDFN-8 Maxim; PRICE: None; PURCHASE-URL: https://www.snapeda.com/api/url_track_click_mouser/?unipart_id=329239&manufacturer=Analog Devices&part_name=MAX17048G+T10&search_term=None; SNAPEDA_LINK: https://www.snapeda.com/parts/MAX17048G+T10/Analog+Devices/view-part/?ref=snap
X1 = InkTime_v5:NORDIC_NRF_XTAL_32MHZ
X2 = InkTime_v5:NORDIC_NRF_1_XTAL_32KHZ

## Board
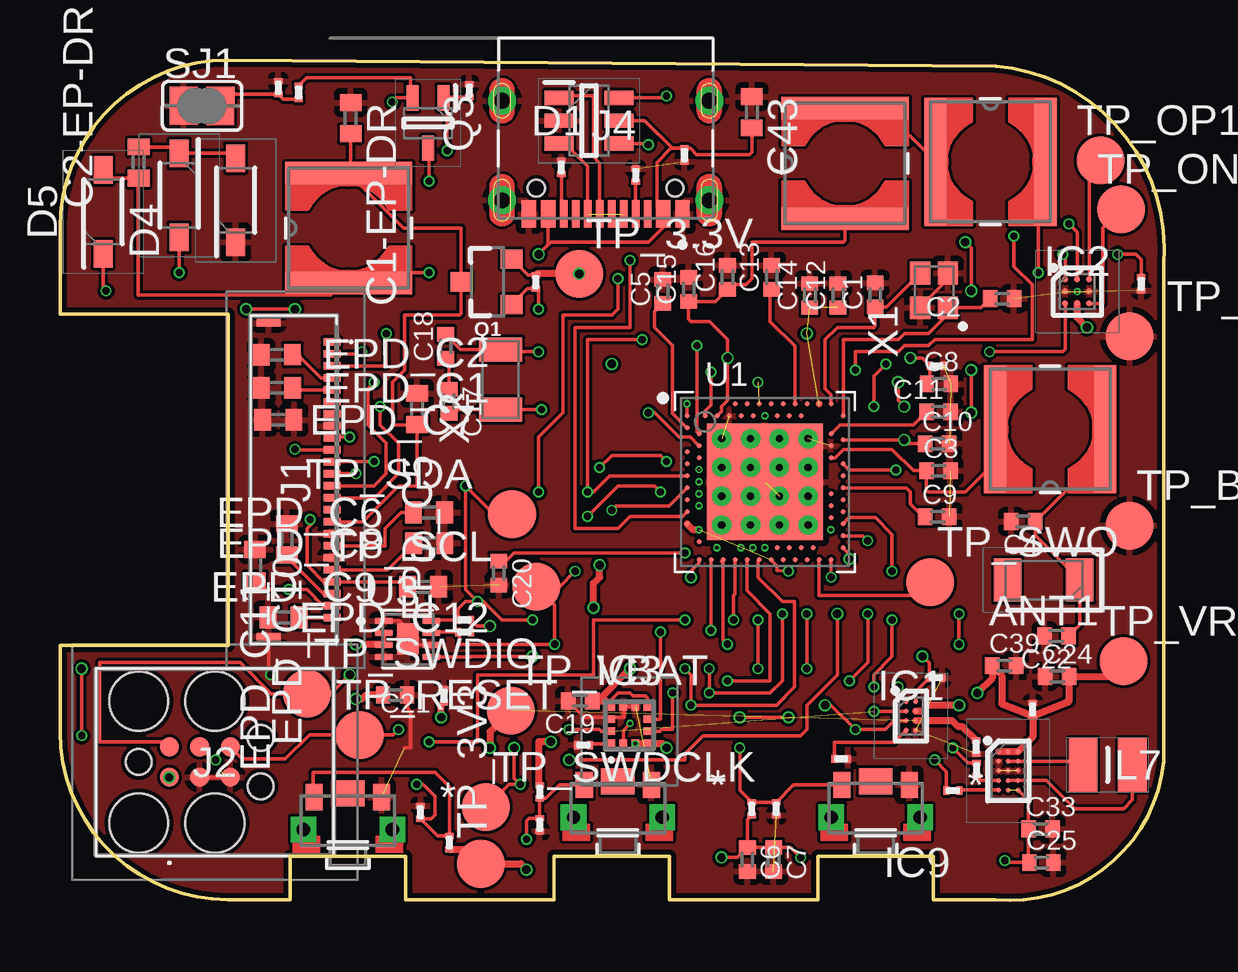
[diagram p2: board, top side]
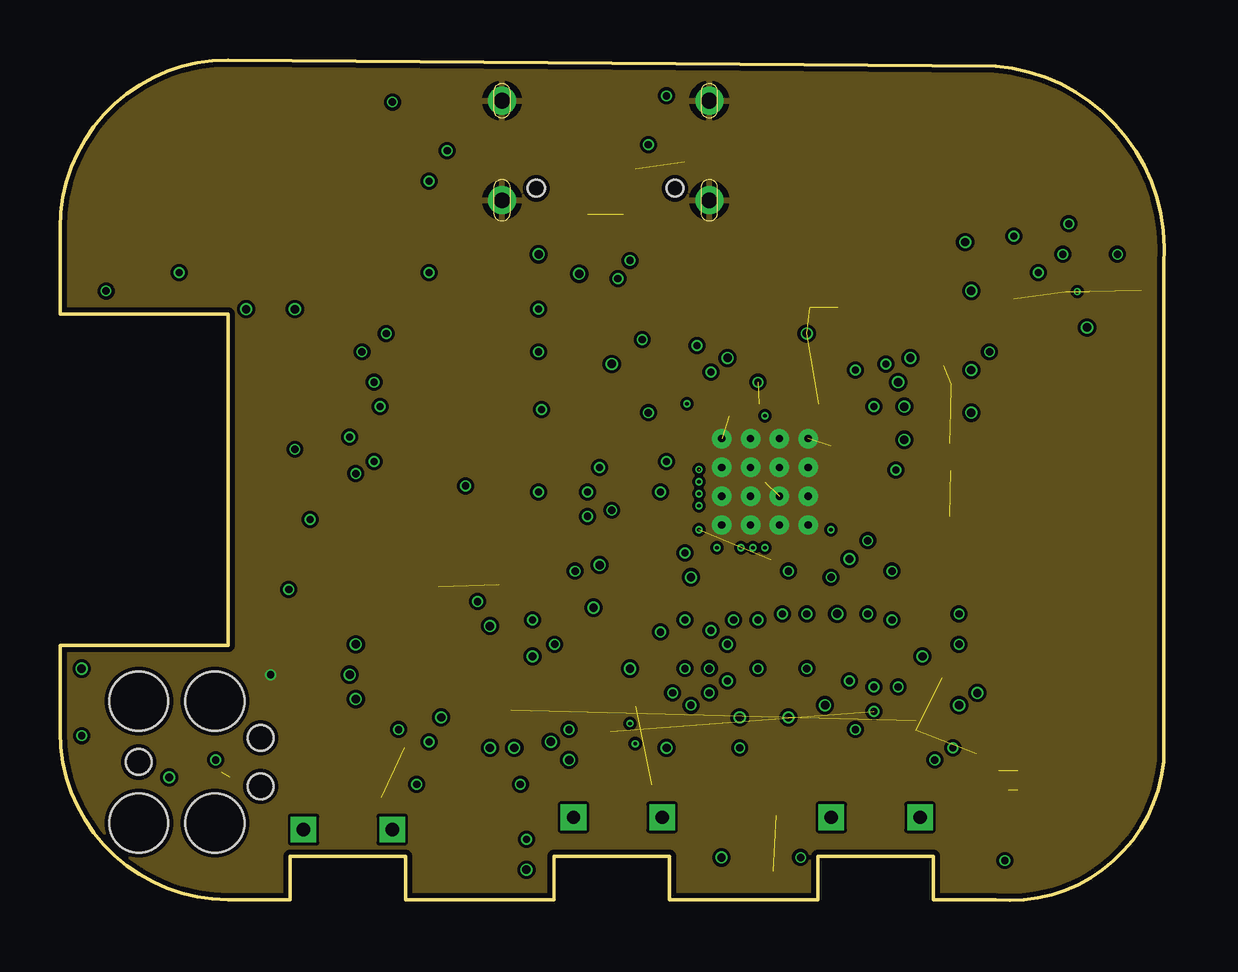
[diagram p3: board, inner layer Route2]
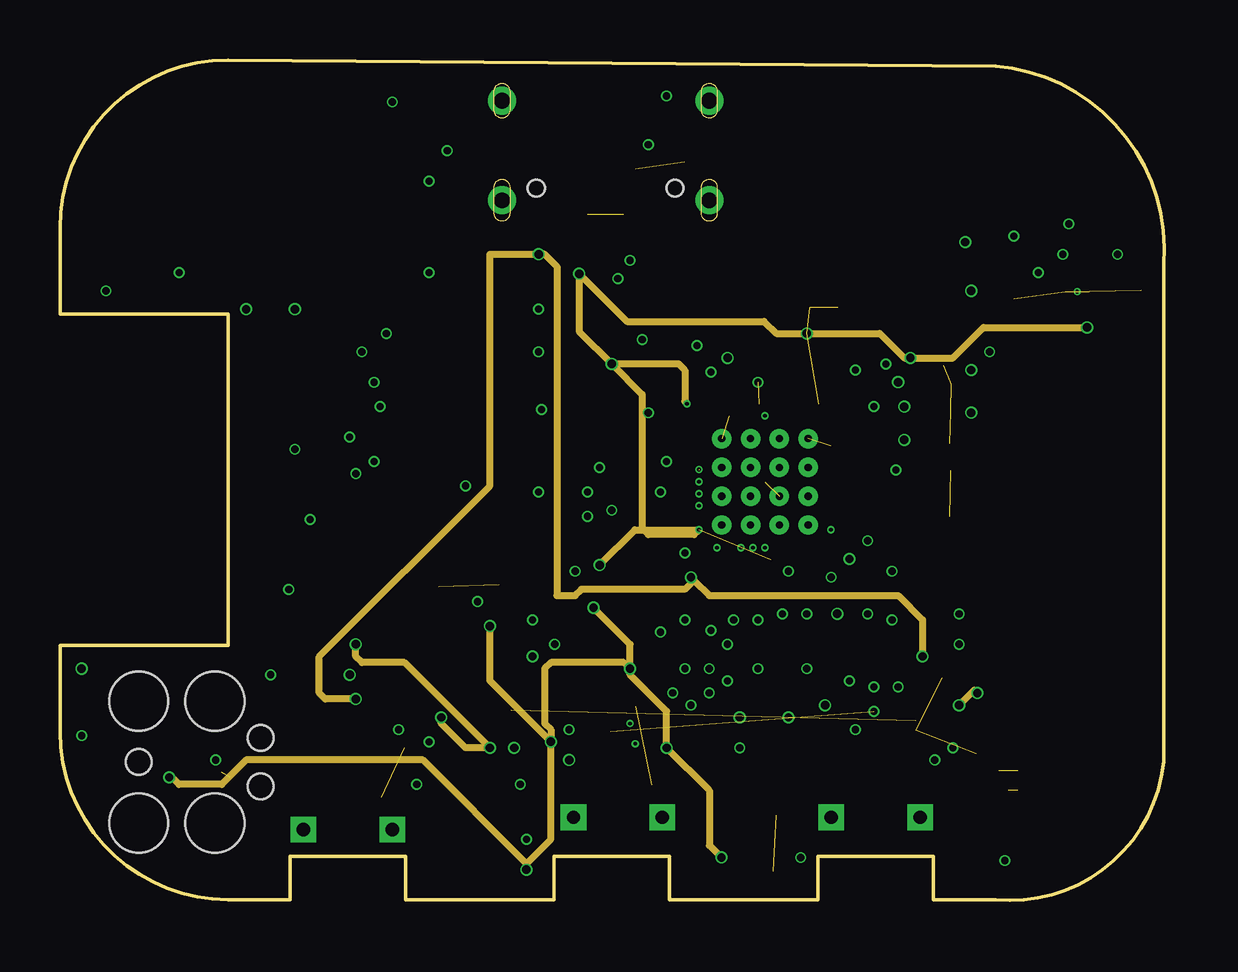
[diagram p4: board, inner layer Route15]
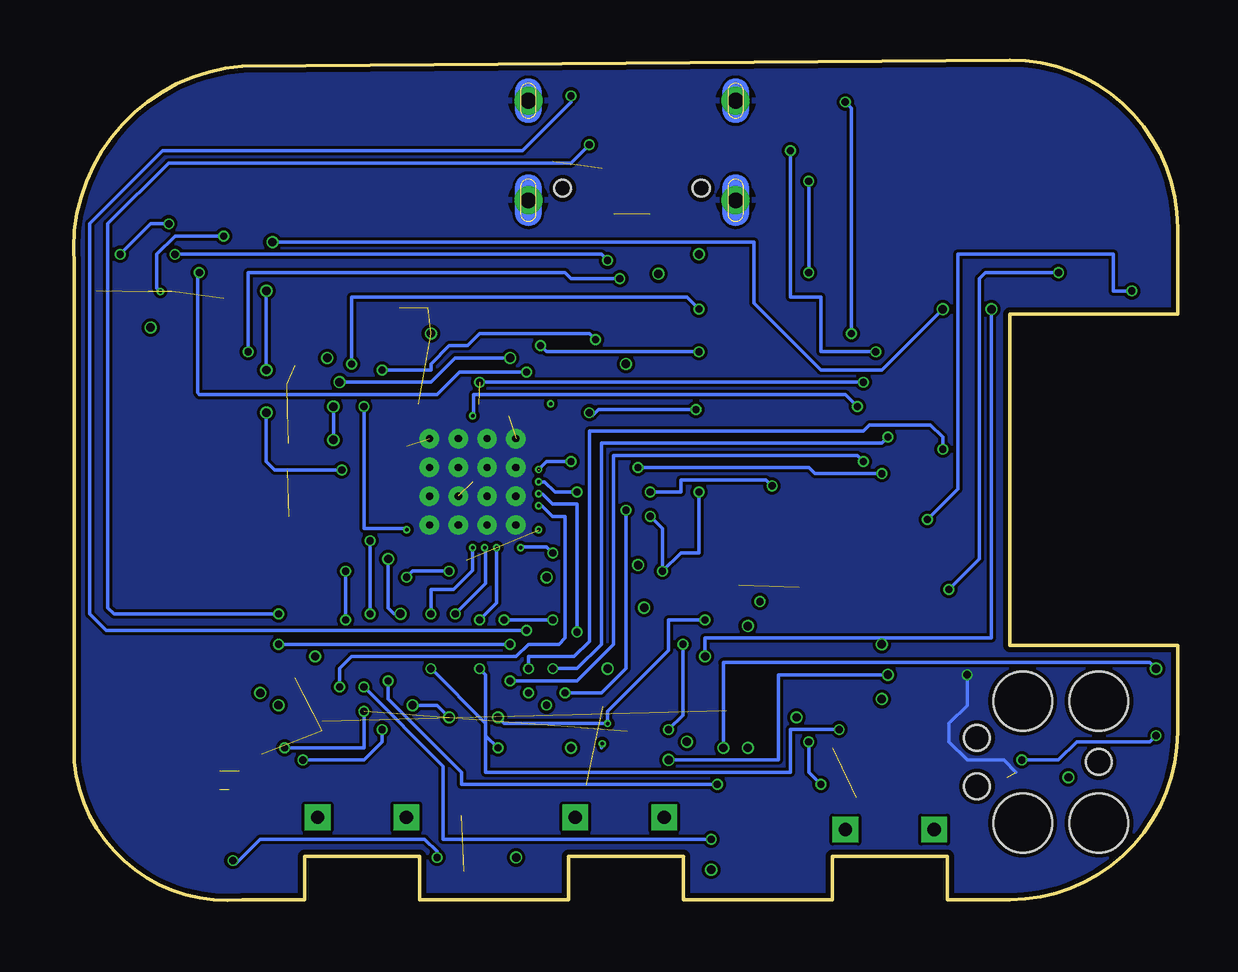
[diagram p5: board, bottom side, seen from below]

Size 46.03 x 35.03 mm. Coordinates in mm from the lower left corner, seen from the top.
Outline: 7,35.03 arc90 0,28.03 0,24.43 7,24.43 7,10.63 0,10.63 0,7.03 arc90 7,0.03 9.6,0.03 9.6,1.83 14.4,1.83 14.4,0.03 20.6,0.03 20.6,1.83 25.4,1.83 25.4,0.03 31.6,0.03 31.6,1.83 36.4,1.83 36.4,0.03 39,0.03 arc90 46,5.76 46,26.51 arc90 39,34.78 7,35.03
Copper layers (1+2*15+16): Top 0.035mm / dielectric 1.6mm / Route2 0.035mm / dielectric 0.15mm / Route15 0.035mm / dielectric 0.2mm / Bottom 0.035mm
Design rules "jlcpcb-2layers.dru *": minimum track width 5mil, minimum drill 0.3mm, track to track 5mil, track to pad 5mil, pad to pad 5mil, via to via 5mil, smd to smd 5mil, copper to edge 0.2mm, drill to drill 6mil, minimum pad ring 10mil, minimum via ring 3mil, stop-mask expansion 4mil, vias tented up to drill 0mil, thermal gap 10mil

### Footprints (pad centres in the part's own frame; a part is rotated, then mirrored left to right if it is on the bottom)
2450AT18B100E_ANTC3216X140N = smd 1.15 x 1.8: 1 -1.5,0; 2 1.5,0
PERFECT_0402_0402 = smd 0.6 x 0.7: 1 -0.5,0; 2 0.5,0
ESP32_C6_LIBRARY_1_ESP32_WROVER_EAGLE-LTSPICE_C0402 = smd 0.7 x 0.9: 1 -0.65,0; 2 0.65,0
GRM011R60J152KE01L_1_0201 = smd 0.35 x 0.25: 1 0,0.275; 2 0,-0.275
ESP32_C6_LIBRARY_3_SOT95P280X145-6N = smd 1.2 x 0.6: 1 -1.25,0.95; 2 -1.25,0; 3 -1.25,-0.95; 4 1.25,-0.95; 5 1.25,0; 6 1.25,0.95
ESP32_C6_LIBRARY_5_SOD3716X135N = smd 1.15 x 0.8: 1 -1.75,0; 2 1.75,0
BQ25180YBGR_BGA8C40P2X4_100X155X50 = smd 0.2 x 0.2: A1 -0.2,0.6; A2 0.2,0.6; B1 -0.2,0.2; B2 0.2,0.2; C1 -0.2,-0.2; C2 0.2,-0.2; D1 -0.2,-0.6; D2 0.2,-0.6
DRV2605YZFR_BGA9C50P3X3_144X144X62 = smd 0.25 x 0.25: A1 -0.5,0.5; A2 0,0.5; A3 0.5,0.5; B1 -0.5,0; B2 0,0; B3 0.5,0; C1 -0.5,-0.5; C2 0,-0.5; C3 0.5,-0.5
BMA423_BMA423 = smd 0.3 x 0.35: 1 -0.75,-0.775; 2 -0.25,-0.775; 3 0.25,-0.775; 4 0.75,-0.775; 7 0.75,0.775; 8 0.25,0.775; 9 -0.25,0.775; 10 -0.75,0.775 | smd 0.35 x 0.3: 5 0.775,-0.25; 6 0.775,0.25; 11 -0.775,0.25; 12 -0.775,-0.25
RT6160AWSC_BGA15C40P3X5_140X230X60 = smd 0.216 x 0.216: A1 -0.4,0.8; A2 0,0.8; A3 0.4,0.8; B1 -0.4,0.4; B2 0,0.4; B3 0.4,0.4; C1 -0.4,0; C2 0,0; C3 0.4,0; D1 -0.4,-0.4; D2 0,-0.4; D3 0.4,-0.4; E1 -0.4,-0.8; E2 0,-0.8; E3 0.4,-0.8
503480-2400_5034802400 = smd 0.3 x 0.7: 1 -5.75,1.525; 2 -5.25,1.525; 3 -4.75,1.525; 4 -4.25,1.525; 5 -3.75,1.525; 6 -3.25,1.525; 7 -2.75,1.525; 8 -2.25,1.525; 9 -1.75,1.525; 10 -1.25,1.525; 11 -0.75,1.525; 12 -0.25,1.525; 13 0.25,1.525; 14 0.75,1.525; 15 1.25,1.525; 16 1.75,1.525; 17 2.25,1.525; 18 2.75,1.525; 19 3.25,1.525; 20 3.75,1.525; 21 4.25,1.525; 22 4.75,1.525; 23 5.25,1.525; 24 5.75,1.525 | smd 0.3 x 1: MP1 -6.54,-1.125; MP2 6.54,-1.125
TC2030-IDC_TC2030IDC = smd 0.783 x 0.783: 1 -0.953,-0.635; 2 -0.953,0.635; 3 0.317,-0.635; 4 0.317,0.635; 5 1.588,-0.635; 6 1.588,0.635 | hole 2.451: -2.223,-2.54; -2.223,2.54; 0.952,-2.54; 0.952,2.54 | hole 1.067: -2.223,0; 2.857,-1.016; 2.857,1.016
KH-TYPE-C-16P_KINGHELM_KH-TYPE-C-16P = smd 0.6 x 1.15: A1_B12 -3.2,4.725; A4_B9 -2.4,4.725; A9_B4 2.4,4.725; A12_B1 3.2,4.725 | smd 0.3 x 1.15: A5 -1.25,4.725; A6 -0.25,4.725; A7 0.25,4.725; A8 1.25,4.725; B5 1.75,4.725; B6 0.75,4.725; B7 -0.75,4.725; B8 -1.75,4.725 | drill 0.65 pad 1.05: SH1 -4.32,0; SH2 4.32,0; SH3 -4.32,4.15; SH4 4.32,4.15 | hole 0.7: -2.89,3.65; 2.89,3.65
ESP32_C6_LIBRARY_2_IND_4828-WE-TPC_WRE = smd 0.9 x 5.3: 1 -2.286,0; 2 2.286,0
MLP2016SR47MT0S1_INDC2016X100N = smd 1.2 x 2.2: 1 -1.028,0; 2 1.028,0
ESP32_C6_LIBRARY_4_ESP32_C6_LIBRARY_4_ESP32_C6_LIBRARY_4_ESP32_C6_LIBRARY_4_ESP32_WROVER_SPARKFUN-DISCRETESEMI_SOT23-3 = smd 0.8 x 0.9: 1 -0.95,-1; 2 0.95,-1; 3 0,1.1
ESP32_C6_LIBRARY_6_SOT65P210X110-3N = smd 1.05 x 0.5: 1 -1.05,0.65; 2 -1.05,-0.65; 3 1.05,0
ERA-1AEB3401C_0201 = smd 0.35 x 0.25: 1 0,0.275; 2 0,-0.275
ESP32_C6_LIBRARY_7_JUMPER_SJ = smd 1.168 x 1.6: 1 -0.762,0; 2 0.762,0
2025-10-22_07-23-44_LIBRARY_SW_EVP-AKE31A_PAN = smd 0.711 x 1.092: 1 -1.4,-0.972; 2 1.4,-0.972 | drill 0.559 pad 0.914 square: 3 -1.848,0.381; 4 1.848,0.381 | smd 1.397 x 1.092: 5 0,-1.124
HECTOR_WATCH_1_TP20R = smd 2 x 2: TP 0,0
NORDIC_NRF_4_AQFN50P700X700X85_HS-74N = smd 4.85 x 4.85: P$74 0,0 | drill 0.3 pad 0.6: P$75 -1.8,1.8; P$76 -0.6,1.8; P$77 0.6,1.8; P$78 1.8,1.8; P$79 -1.8,0.6; P$80 -0.6,0.6; P$81 0.6,0.6; P$82 1.8,0.6; P$83 -1.8,-0.6; P$84 -0.6,-0.6; P$85 0.6,-0.6; P$86 1.8,-0.6; P$87 -1.8,-1.8; P$88 -0.6,-1.8; P$89 0.6,-1.8; P$90 1.8,-1.8 | smd 0.2 x 0.2: P$A8 -1.25,3.25; P$A10 -0.75,3.25; P$A12 -0.25,3.25; P$A14 0.25,3.25; P$A16 0.75,3.25; P$A18 1.25,3.25; P$A20 1.75,3.25; P$A22 2.25,3.25; P$A23 2.75,3.25; P$AA24 3.25,-2.25; P$AB2 -2.75,-2.5; P$AC5 -2,-2.75; P$AC9 -1,-2.75; P$AC11 -0.5,-2.75; P$AC13 0,-2.75; P$AC15 0.5,-2.75; P$AC17 1,-2.75; P$AC19 1.5,-2.75; P$AC21 2,-2.75; P$AC24 3.25,-2.75; P$AD2 -2.75,-3.25; P$AD4 -2.25,-3.25; P$AD6 -1.75,-3.25; P$AD8 -1.25,-3.25; P$AD10 -0.75,-3.25; P$AD12 -0.25,-3.25; P$AD14 0.25,-3.25; P$AD16 0.75,-3.25; P$AD18 1.25,-3.25; P$AD20 1.75,-3.25; P$AD22 2.25,-3.25; P$AD23 2.75,-3.25; P$B1 -3.25,2.75; P$B3 -2.5,2.75; P$B5 -2,2.75; P$B7 -1.5,2.75; P$B9 -1,2.75; P$B11 -0.5,2.75; P$B13 0,2.75; P$B15 0.5,2.75; P$B17 1,2.75; P$B19 1.5,2.75; P$B24 3.25,2.75; P$C1 -3.25,2.25; P$D2 -2.75,2; P$D23 2.75,2; P$E24 3.25,1.75; P$F2 -2.75,1.5; P$F23 2.75,1.5; P$G1 -3.25,1.25; P$H2 -2.75,1; P$H23 2.75,1; P$J1 -3.25,0.75; P$J24 3.25,0.75; P$K2 -2.75,0.5; P$L1 -3.25,0.25; P$L24 3.25,0.25; P$M2 -2.75,0; P$N1 -3.25,-0.25; P$N24 3.25,-0.25; P$P2 -2.75,-0.5; P$P23 2.75,-0.5; P$R1 -3.25,-0.75; P$R24 3.25,-0.75; P$T2 -2.75,-1; P$T23 2.75,-1; P$U1 -3.25,-1.25; P$U24 3.25,-1.25; P$V23 2.75,-1.5; P$W1 -3.25,-1.75; P$W24 3.25,-1.75; P$Y2 -2.75,-2; P$Y23 2.75,-2
ESP32_C6_LIBRARY_SON50P200X200X80-9N = smd 0.76 x 0.27: 1 -0.985,0.75; 2 -0.985,0.25; 3 -0.985,-0.25; 4 -0.985,-0.75; 5 0.985,-0.75; 6 0.985,-0.25; 7 0.985,0.25; 8 0.985,0.75 | smd 0.9 x 1.3: 9 0,0
NORDIC_NRF_BT-XTAL_2016_N = smd 0.95 x 0.85: 1 -0.725,-0.575; 2 0.725,-0.575; 3 0.725,0.575; 4 -0.725,0.575
NORDIC_NRF_1_XTAL_3215_N = smd 1 x 1.8: 1 -1.25,0; 2 1.25,0

### Placement (x,y rotation side)
ANT1  41.01,13.35 180 top
C1  33.98,25.23 90 top
C1-EP-DR  12.12,32.61 270 top
C2  39.26,25.08 0 top
C2-EP-DR  3.28,30.76 90 top
C3  36.62,17.91 0 top
C4  40.15,15.79 180 top
C5  25.12,25.38 90 top
C6  28.65,1.7 270 top
C7  29.75,1.7 270 top
C8  36.64,21.53 0 top
C9  36.57,15.99 0 top
C10  36.57,19.03 0 top
C11  36.62,20.37 0 top
C12  32.43,25.21 90 top
C13  29.66,25.97 90 top
C14  31.25,25.21 90 top
C15  26.21,25.46 90 top
C16  27.82,25.97 90 top
C17  16.22,20.8 270 top
C18  16.08,23.09 90 top
C19  21.68,8.32 179.9 top
C20  18.3,13.64 270 top
C21  13.97,8.56 0 top
C22  41.54,11.02 180 top
C23  40.55,7.95 180 top
C24  41.56,9.34 0 top
C25  40.91,1.57 0 top
C27  16.01,8.53 0 top
C29  19.99,3.14 180 top
C30  15.03,3.67 0 top
C31  29.86,3.82 180 top
C32  45.07,25.7 180 top
C33  40.87,2.97 0 top
C34  36.54,22.29 270 top
C37  38.19,6.39 180 top
C38  36.51,9.28 270 top
C39  39.36,9.78 0 top
C42  26.03,31.07 0 top
C43  28.84,32.85 270 top
D1  22.05,32.5 0 top
D2  4.97,29.39 270 top
D4  7.32,29.19 90 top
D5  1.8,28.71 90 top
EPD_C1  9.04,21.36 0 top
EPD_C2  9.04,22.74 0.7 top
EPD_C5  14.88,20.49 270 top
EPD_C6  15.38,16.17 180 top
EPD_C7  9.1,20.03 180 top
EPD_C8  15.39,14.89 180 top
EPD_C9  15.14,13.07 180 top
EPD_C10  9.46,15.05 270 top
EPD_C11  8.13,13.98 270 top
EPD_C12  9.32,11.79 0 top
IC1  35.47,7.68 0 top
IC2  42.4,25.38 0 top
IC3  23.73,7.3 0 top
IC9  39.53,5.4 0 top
J1  9.81,17.53 270 top
J2  5.51,5.76 0 top
J4  22.75,33.33 180 top
L1  41.27,19.64 180 top
L2  38.79,30.79 0 top
L3  32.72,30.72 90 top
L5  12.03,28.03 90 top
L7  43.67,5.65 0 top
Q1  17.82,25.79 90 top
Q3  15.34,32.4 270 top
R1_EP_DR  9.95,33.68 180 top
R1_USB  23.99,30.23 0 top
R2  37.22,4.58 90 top
R2_EP_DR  17.06,33.75 0 top
R2_USB  20.9,30.55 180 top
R3  21.82,6.47 90 top
R4  38.21,5.45 0 top
R5  16.24,2.41 0 top
R7  19.99,4.52 180 top
R8  28.84,3.82 0 top
R9  32.56,5.9 270 top
R17  16.86,11.18 270 top
R18  16.86,11.69 270 top
R_PWR_EPD  19.83,25.78 180 top
R_TYPE_SEL  9.1,33.88 0 top
SJ1  5.92,33.12 359.7 top
SW_DN  23.25,3.84 180 top
SW_ENT  34,3.84 180 top
SW_UP  12,3.33 180 top
TP_3.3V  21.64,26.12 0 top
TP_3V3  17.53,1.52 0 top
TP_BAT_GND  44.59,15.62 0 top
TP_GND  44.59,23.5 0 top
TP_ON  44.23,28.81 0 top
TP_OP1  43.37,30.84 0 top
TP_RESET  12.49,6.89 0 top
TP_SCL  19.86,13.07 0 top
TP_SDA  18.84,16.09 0 top
TP_SWDCLK  17.76,3.88 0 top
TP_SWDIO  10.3,8.61 0 top
TP_SWO  36.28,13.26 0 top
TP_VBAT  18.8,7.91 0 top
TP_VREG  44.33,9.97 0 top
U1  29.39,17.45 0 top
U3  14.49,10.89 0 top
X1  36.44,25.42 90 top
X2  18.37,21.71 90 top

### Tracks (layer width: path | path; a pad name or v marks a point on that pad's centre or on a via)
3V3  (via drill 0.15, 0.3, 0.35)  (5 unrouted)
  Top 0.15: IC9.E3 40.37,4.16 C33.1 40.37,1.61 C25.1 39.47,1.57 v39.38,1.66 | C8.1 36.27,21.66 C34.2 35.94,22.61 v35.45,22.61 | C6.1 28.88,2.42 | C6.1 C7.1 30.46,2.2 v30.87,1.78 | R17.1 R18.1 17.39,11.44 v17.92,11.44 | 19.89,26.12 R_PWR_EPD.2 19.5,26.05 Q1.2 | v30.37,13.72 29.89,13.74 29.89,13.94 U1.P$AD14 | v32.14,13.47 U1.P$AD23 | R8.2 28.65,3.36 C6.1 | IC3.7 24.48,8.43 24.4,8.51 23.89,8.51 23.76,8.64 23.25,8.64 22.98,8.37 IC3.10 | v26.14,20.7 U1.P$B1 | C6.1 28.24,1.78 v27.57,1.78
  Top 0.3: U1.P$A22 | v42.81,23.88 42.4,24.29 IC2.C2 | v25.29,6.36 25.12,6.52 IC3.3 | v23.76,9.66 22.42,8.31 C19.1 22.74,8.31 IC3.10 | TP_3.3V.TP 19.89,26.12 | U1.P$Y2 26.39,15.45 U1.P$W1 | v19.44,1.28 19.2,1.52 TP_3V3.TP 16.92,2.13 R5.2 | v20.46,6.61 19.95,6.61 19.95,4.83 R7.2 | v22.24,12.2 22.24,13.21 22.49,13.47 v22.49,13.98
  Route15 0.3: v23,22.36 21.64,23.71 TP_3.3V.TP 23.63,24.14 29.35,24.14 29.86,23.63 v31.13,23.63 34.18,23.63 35.19,22.61 v35.45,22.61 37.22,22.61 38.49,23.88 v42.81,23.88 | v26.14,20.7 26.05,20.79 26.05,22.1 25.79,22.36 v23,22.36 | v27.57,1.78 27.06,2.29 27.06,4.58 v25.29,6.36 25.29,7.88 23.76,9.4 v23.76,9.66 | v23,22.36 24.27,21.09 24.27,15.5 24.52,15.25 26.44,15.25 U1.P$Y2 23.96,15.45 v22.49,13.98 | 19.44,1.53 20.46,2.55 v20.46,6.61 | v19.44,1.28 19.44,1.53 | v23.76,9.66 23.51,9.91 20.46,9.91 20.21,9.66 20.21,7.37 20.46,7.12 v20.46,6.61 | 19.44,1.53 15.13,5.85 7.76,5.85 6.74,4.83 4.97,4.83 4.67,5.13 J2.1 | v20.46,6.61 17.92,9.15 v17.92,11.44 | v23.76,9.66 23.76,10.67 v22.24,12.2
  Bottom 0.15: v32.14,13.47 31.89,13.72 v30.37,13.72 | v30.87,1.78 30.87,2.04 31.38,2.55 38.24,2.55 39.26,1.53 v39.38,1.66 | IC3.3 24.02,6.49 24.02,6.36
  other vias: 21.64,26.12 23.98,6.52 26.64,15.45 4.55,5.13
ALERT  (via drill 0.3, 0.35)
  Top 0.15: v34.84,17.94 32.89,17.94 U1.P$J24 | U3.5 17.14,10.14 17.16,10.17 v19.7,10.17 | v37.99,20.33 v37.99,22.1 | v37.99,25.41 37.99,27.18 v37.73,27.44 | v9.79,24.64 v7.76,24.64
  Bottom 0.15: v34.84,17.94 37.63,17.94 37.99,18.29 v37.99,20.33 | v37.99,22.1 v37.99,25.41 | v37.73,27.44 17.67,27.44 17.67,24.9 14.87,22.1 12.33,22.1 v9.79,24.64 | v7.76,24.64 7.76,10.93 19.7,10.93 v19.7,10.17
D+  (via drill 0.3)
  Top 0.15: D1.4 24.48,31.55 v24.52,31.5 | v37.48,11.94 v37.48,10.67 | 27.57,14.13 U1.P$AD6 27.64,10.86 v27.83,10.67
  Bottom 0.15: v24.52,31.5 25.29,30.74 42.05,30.74 44.59,28.2 44.59,12.2 44.34,11.94 v37.48,11.94 | v37.48,10.67 v27.83,10.67
D-  (via drill 0.3)
  Top 0.15: v25.29,33.53 25.2,33.45 D1.6 | U1.P$AD4 v27.14,11.25
  Bottom 0.15: v27.14,11.25 44.66,11.25 45.35,11.94 45.35,28.2 42.3,31.25 27.32,31.25 25.29,33.28 v25.29,33.53
DEC1
  Top 0.15: C5.1 24.78,24.53 24.78,23.88 25.54,23.12 25.54,20.29 U1.P$C1
DEC3
  Top 0.15: U1.P$D23 32.51,19.82 35.57,19.82 C11.1
DEC4_6  (via drill 0.35)
  Top 0.15: 35.91,19.2 C10.1 35.35,19.03 v35.19,19.2 U1.P$E24 | L3.1 32.72,27.51 32.65,27.44 28.84,27.44 28.84,25.91 28.59,25.66 28.01,25.66 C16.1 27.31,24.96 C15.1 26.21,24.23 26.3,24.14 27.06,24.14 27.64,23.56
  Top 0.152: U1.P$B5 27.57,20.38 27.57,20.58 27.83,20.83 v27.83,22.61 27.83,23.37 27.64,23.56 | v34.94,21.6 34.94,20.83 v35.19,20.58
  Bottom 0.152: v27.83,22.61 30.11,22.61 31.13,21.6 v34.94,21.6 | v35.19,20.58 v35.19,19.2
DN  (1 unrouted)
  Top 0.15: J4.A7 22.5,30.74 22.24,30.99 22.24,33.53 20.89,33.53 D1.1
DP  (1 unrouted)
  Top 0.15: D1.3 21.06,31.55 22,30.61 J4.B6
EPD_3V3
  Top 0.15: C1-EP-DR.2 12.12,30.4 L5.2 14.32,28.03 16.72,28.03 Q1.3 16.72,24.46 16.65,24.39 14.36,24.39 14.36,22.1 13.86,21.6 13.86,19.82 14.87,19.82 EPD_C5.2 14.88,17.29 14.87,17.28 14.11,17.28 12.61,15.78 J1.16 J1.15
EPD_BUSY  (via drill 0.3)
  Top 0.15: J1.9 11.37,19.31 v12.08,19.31 | U1.P$AD12 29.1,14.15 29.1,13.47 30.11,12.45 30.62,12.45 30.62,8.9 29.86,8.13 v26.3,8.13 26.3,9.4 v26.05,9.66
  Bottom 0.15: v12.08,19.31 12.33,19.06 24.02,19.06 24.02,10.67 25.03,9.66 v26.05,9.66
EPD_CS  (via drill 0.15, 0.3)  (1 unrouted)
  Top 0.15: J1.12 v12.33,17.79 | v22.49,18.04 23,18.55 25.03,18.55 v25.29,18.29
  Bottom 0.15: v26.64,17.96 U1.P$K2 | v12.33,17.79 15.13,17.79 15.38,18.04 v22.49,18.04 | 26.56,18.04 v26.64,17.96 | v25.29,18.29 26.3,18.29 v26.64,17.96
EPD_DC  (via drill 0.3)
  Top 0.15: J1.11 11.35,18.29 v13.09,18.29 | U1.P$AD10 28.64,12.91 29.6,11.94 29.6,9.15 v27.83,9.15
  Bottom 0.15: v13.09,18.29 13.35,18.55 23.51,18.55 23.51,10.67 25.03,9.15 v27.83,9.15
EPD_RST  (via drill 0.15, 0.3)
  Top 0.15: J1.10 9.81,18.78 v9.79,18.8 | v30.11,11.94 30.11,9.15 29.6,8.64 v27.06,8.64 v27.06,9.66
  Bottom 0.15: v9.79,18.8 9.79,19.31 10.3,19.82 12.84,19.82 13.09,19.56 24.52,19.56 24.52,10.8 25.16,10.17 27.06,10.17 v27.06,9.66 | U1.P$AC11 28.84,14.74 28.84,13.21 v30.11,11.94
  other vias: 28.89,14.7
GDR  (via drill 0.3)
  Top 0.15: R2_EP_DR.2 16.02,33.47 Q3.1 16.14,33.3 v16.14,31.25 | J1.2 12.5,22.78 v12.59,22.87
  Bottom 0.15: v16.14,31.25 16.14,25.15 14.87,25.15 14.87,22.87 v12.59,22.87
GND  (via drill 0.3)  (20 unrouted)
  Top 0.15: X1.2 37.01,25.9 36.12,25 36.12,24.95 X1.4 | J1.MP2 8.69,9.49 v8.78,9.4 | J2.5 J2.3 | U3.1 14.16,11.64 14.49,11.31 14.49,10.93 | 14.49,10.93 U3.9 | U3.6 14.78,10.64 14.49,10.93 | IC3.8 IC3.9 23.51,8.05 23.51,7.63 21.88,7.63 C19.2 | C21.2 14.47,8.03 14.62,7.88 14.62,6.36 14.36,6.36
  Bottom 0.15: v8.78,9.4 8.78,8.13 9.54,7.37 9.54,6.61 8.78,5.85 7.25,5.85 6.74,5.34
  pour Route2: 0.93,-8.55 45.32,-8.55 54.17,0.29 54.17,35.28 47.86,41.59 0.29,41.59 -7.66,36.29 -7.66,0.04
  pour Top: 2.46,-2.97 43.54,-2.97 49.34,2.83 49.34,32.23 43.54,38.03 4.74,38.03 -2.58,30.71 -2.58,2.07
  pour Bottom: 2.2,-6.52 43.8,-6.52 51.88,1.56 51.88,34.26 45.83,40.32 2.2,40.32 -5.37,32.74 -5.37,1.05
HAPTIC_EN  (via drill 0.3)
  Top 0.15: v23.76,26.68 23.76,23.88 21.48,23.88 21.48,15.5 23.25,15.5 23.76,16.01 25.95,16.01 U1.P$U1 | v41.8,26.93 41.9,26.82 IC2.A1
  Bottom 0.15: v23.76,26.68 24.02,26.93 v41.8,26.93
IMU_INT1  (via drill 0.3)
  Top 0.15: U1.P$N1 25.38,16.43 23.17,16.43 v23,16.26 | IC3.5 25.01,7.05 25.08,7.12 25.54,7.12 v25.54,8.64
  Bottom 0.15: v25.54,8.64 24.02,8.64 23,9.66 v23,16.26
IMU_INT2  (via drill 0.15, 0.3)
  Top 0.15: IC3.6 25.01,7.55 25.03,7.57 v25.03,11.18
  Bottom 0.15: v25.03,11.18 25.03,16.52 26.05,16.52 26.48,16.95 U1.P$P2
  other vias: 26.64,16.95
LX1
  Top 0.15: IC9.B2 IC9.B3 42.5,5.8 L7.1
LX2
  Top 0.15: IC9.D2 IC9.D3 41.12,5 42.3,3.82 44.34,3.82 44.7,4.18 L7.2
MOSI  (via drill 0.15, 0.3)
  Top 0.15: J1.14 13.11,16.78 14.11,17.79 14.11,19.06 13.35,19.82 v13.35,20.58
  Bottom 0.15: v13.35,20.58 13.86,21.09 29.35,21.09 29.35,20.23 U1.P$B13
  other vias: 29.39,20.2
N$18  (via drill 0.15, 0.3)
  Top 0.15: v26.05,14.48 18.94,14.48 18.59,14.14 C20.1
  Bottom 0.15: v26.05,14.48 26.3,14.74 27.34,14.74 U1.P$AC5
  other vias: 27.39,14.7
N$33
  Top 0.15: J1.4 10.88,21.78 9.91,22.75 EPD_C2.2
N$58
  Top 0.15: U1.P$N24 35.27,17.2 35.45,17.02 35.45,16.52 35.97,15.99 C9.1
N$60
  Top 0.15: C17.1 16.22,22.45 C18.1
N$62  (via drill 0.3)
  Top 0.15: v40.78,26.17 40.78,30.49 L2.2 | U1.P$B3 26.89,20.4 27.14,20.66 v27.14,22.03
  Bottom 0.15: v40.78,26.17 40.86,26.17 40.86,21.16 40.78,21.09 30.87,21.09 29.93,22.03 v27.14,22.03
N$64
  Top 0.15: L3.2 34.28,33.01 L2.1
N$66
  Top 0.15: U1.P$A18 30.64,23.1 29.6,24.14 29.6,25.41 C13.1
N$68
  Top 0.15: U1.P$A23 32.14,20.94 32.14,21.09 31.89,21.34 31.89,23.37 32.4,23.88 33.16,23.88 33.92,23.88 33.98,23.94 C1.1 34.45,24.73 X1.3
N$69
  Top 0.15: C2.1 38.38,24.7 X1.1 37.01,24.43 36.21,23.63 35.19,23.63 34.94,23.37 32.65,23.37 32.65,20.21 U1.P$B24
N$70
  Top 0.15: J1.18 13.56,14.78 13.56,15.5 14.23,16.17 EPD_C6.2
N$71
  Top 0.15: U1.P$H23 32.3,18.45 32.65,18.8 34.68,18.8 35.58,17.91 C3.1 36.12,17.11 36.21,17.02 37.73,17.02 38.99,18.28 L1.2
N$72
  Top 0.15: J1.5 9.78,21.28 EPD_C1.2
N$78
  Top 0.15: IC3.1 22.15,6.52 R3.2
N$89
  Top 0.15: IC1.D1 34.76,6.58 32.29,6.58 R9.2
N$99
  Top 0.15: R4.2 38.39,5 IC9.D1
N$100
  Top 0.15: R2.2 37.52,4.6 IC9.E1
N$109
  Top 0.15: J1.20 13.66,13.78 14.74,14.86 EPD_C8.2
N$111
  Top 0.15: J1.22 10.99,12.78 9.46,14.31 EPD_C10.2
N$113
  Top 0.15: J1.24 10.06,11.78 EPD_C12.2
N$121  (via drill 0.3)
  Top 0.15: D5.2 2.15,30.11 C2-EP-DR.1 3.27,25.23 11.27,25.23 11.78,25.74 L5.1 12.46,26.17 v15.38,26.17 | v15.38,29.98 15.38,31.31 Q3.3
  Bottom 0.15: v15.38,26.17 v15.38,29.98
N$122
  Top 0.15: C2-EP-DR.2 4.7,31.41 D2.1 7.12,31.14 D4.2
N$127
  Top 0.15: SJ1.2 7.18,33.6 R_TYPE_SEL.2 9.3,33.4 R1_EP_DR.1
N$140  (via drill 0.3)
  Top 0.15: v42.05,28.2 42.4,27.85 IC2.A2 | v44.08,26.93 44.84,26.93 45.07,26.7 C32.2
  Bottom 0.15: v42.05,28.2 42.81,28.2 v44.08,26.93
N$162
  Top 0.15: J4.A5 R1_USB.2
N$163
  Top 0.15: J4.B5 20.9,28.71 R2_USB.1
OUT+
  Top 0.15: TP_OP1.TP 42.9,30.37 IC2.A3
OUT-
  Top 0.15: TP_ON.TP 43.47,28.05 43.47,24.88 IC2.C3
P0.00/XL1  (via drill 0.3)
  Top 0.15: C18.2 16.7,22.96 X2.2 18.46,22.87 v19.95,22.87 | U1.P$D2 26.56,19.53 v26.56,23.12
  Bottom 0.15: v26.56,23.12 26.3,22.87 v19.95,22.87
P0.00/XL2  (via drill 0.3)
  Top 0.15: X2.1 16.38,20.46 C17.2 | v24.52,20.33 24.78,20.33 25.79,19.31 26.27,19.31 U1.P$F2 | 18.49,20.58 X2.1 | v20.08,20.45 v20.07,20.46 X2.1
  Bottom 0.15: v20.08,20.45 24.14,20.45 24.4,20.2 v24.52,20.33
P0.13  (via drill 0.3)
  Top 0.15: SW_UP.2 10.55,4.35 10.55,5.34 15.63,5.34 16.24,4.74 R5.1 15.74,2.68 C30.2 15.47,3.4 15.63,3.56 15.63,4.32 15.13,4.83 v14.87,4.83 | U1.P$AD8 28.14,12.76 28.08,12.71 v28.08,11.69 | v15.38,6.61 17.41,6.61 17.41,9.4 22.24,9.4 22.24,11.69 v26.05,11.69
  Bottom 0.15: v28.08,11.69 v26.05,11.69 | v15.38,6.61 15.38,5.34 v14.87,4.83
P0.14  (via drill 0.15, 0.3)
  Top 0.15: SW_ENT.2 30.58,4.81 C31.2 R8.1 28.33,4.59 v28.33,6.36 | v29.1,11.69 v29.1,9.66
  Bottom 0.15: v29.1,9.66 28.84,9.4 28.84,6.86 v28.33,6.36 | 28.33,14.74 28.34,14.74 U1.P$AC9 28.39,12.4 v29.1,11.69
  other vias: 28.39,14.7
P1.01  (via drill 0.15, 0.3)
  Top 0.15: Q1.1 19.49,25.5 R_PWR_EPD.1 19.95,25.38 v19.95,24.64 | v34.43,22.36 33.92,21.85 v33.92,20.58
  Bottom 0.15: v19.95,24.64 20.46,25.15 34.43,25.15 v34.43,22.36 | U1.P$Y23 32.14,15.49 32.14,15.5 33.92,15.5 v33.92,20.58
  other vias: 32.14,15.45
P1.02  (via drill 0.3)
  Top 0.15: U1.P$W24 32.89,15.95 33.98,15.95 34.68,15.25 v34.68,13.72 | v34.68,11.69 34.68,10.17 33.92,9.4 v33.92,8.9 | v19.44,2.55 19.44,3.31 19.55,3.42 C29.2 R7.1 20.25,4.24 20.82,4.81 SW_DN.2
  Bottom 0.15: v34.68,13.72 v34.68,11.69 | v33.92,8.9 30.62,5.59 30.62,2.55 v19.44,2.55
PMIC_INT  (via drill 0.15, 0.3)
  Top 0.15: IC1.A1 34.94,8.62 v34.94,8.9
  Bottom 0.15: v34.94,8.9 34.94,9.66 34.43,10.17 27.57,10.17 27.06,10.67 25.79,10.67 25.54,10.93 25.54,16.01 26.05,16.01 26.49,16.45 U1.P$T2
  other vias: 26.64,16.45
PREVGH  (via drill 0.3)
  Top 0.15: EPD_C9.2 14.27,13.28 J1.21 10.99,13.28 10.3,13.98 10.3,15.5 10.55,15.75 v10.43,15.88 | v1.92,25.41 1.8,25.53 D5.1
  Bottom 0.15: v10.43,15.88 9.16,17.15 9.16,26.93 2.68,26.93 2.68,25.41 v1.92,25.41
PREVGL  (via drill 0.3)
  Top 0.15: J1.23 10.98,12.28 10.3,12.96 v9.54,12.96 8.5,12.96 EPD_C11.2 8.01,13.21 | v4.97,26.17 D2.2
  Bottom 0.15: v9.54,12.96 8.27,14.23 8.27,25.91 8.01,26.17 v4.97,26.17
RESE  (via drill 0.3)
  Top 0.15: R1_EP_DR.2 10.29,34.3 14.62,34.3 14.62,33.52 Q3.2 14.03,33.45 v13.86,33.28 | J1.3 13.6,22.28 v13.6,23.63
  Bottom 0.15: v13.86,33.28 13.6,33.03 v13.6,23.63
RESET  (via drill 0.15, 0.3)
  Top 0.15: v14.11,7.12 13.88,6.89 TP_RESET.TP 10.92,6.89 10.9,6.9 10.4,6.9 9.38,5.89 7.6,5.89 J2.6 | v31.13,11.94 v31.13,9.66
  Bottom 0.15: v31.13,9.66 28.84,7.37 28.84,5.34 16.14,5.34 16.14,7.12 v14.11,7.12 | U1.P$AC13 29.39,13.76 30.19,12.96 31.13,12.96 v31.13,11.94
  other vias: 29.39,14.7
RF
  Top 0.15: L1.1 43.05,19.13 43.05,18.19 C4.1 40.65,15.21 ANT1.1 42.51,11.48 C22.1
SCK  (via drill 0.3)  (1 unrouted)
  Top 0.15: v13.09,21.6 12.84,21.34 12.84,19.82 13.6,19.06 13.6,17.79 13.09,17.28 J1.13
  Bottom 0.15: v29.1,21.6 v13.09,21.6
SCL  (via drill 0.15, 0.3)  (1 unrouted)
  Top 0.15: U3.7 15.51,11.18 R17.2 16.65,11.12 16.65,10.67 v20.62,10.67 20.62,12.31 TP_SCL.TP | IC1.B1 v33.92,7.88 | v37.22,6.36 37.85,5.73 R4.1 | TP_SCL.TP 20.32,13.07 | TP_SCL.TP 20.82,13.07 v21.48,13.72 | v25.03,17.02 24.78,17.28 23.25,17.28 v21.98,16.01 | v21.22,7.12 22.49,7.12 22.56,7.05 IC3.12 | v19.95,17.02 19.95,19.31 20.97,20.33 20.97,24.39 23,24.39 23.25,24.64 v23.25,25.91 | v38.75,22.87 41.8,22.87 41.9,22.97 IC2.C1
  Bottom 0.15: v33.92,7.88 33.92,6.36 v37.22,6.36 | U1.P$M2 26.38,17.45 25.96,17.02 v25.03,17.02 | v21.98,16.01 21.48,15.5 v21.48,13.72 20.71,14.48 19.95,14.48 v19.95,17.02 | v20.62,10.67 20.62,7.72 v21.22,7.12 | v23.25,25.91 25.29,25.91 25.54,26.17 38.75,26.17 v38.75,22.87
  other vias: 26.64,17.45
SDA  (via drill 0.15, 0.3, 0.35)
  Top 0.15: U3.8 15.52,11.69 R18.2 16.59,12.14 16.9,12.45 v17.41,12.45 | IC1.C1 34.76,7.48 34.4,7.12 v33.16,7.12 32.14,8.13 v31.89,8.13 | v36.46,5.85 36.95,5.36 R2.1 | U1.P$L1 22.91,17.7 22.24,17.02 v21.98,17.02 21.98,23.37 v24.27,23.37 | TP_SDA.TP 18.09,16.09 v16.9,17.28 16.9,12.96 v17.41,12.45 | v33.16,22.1 33.16,22.87 34.94,22.87 35.19,23.12 36.21,23.12 36.46,23.37 40.53,23.37 40.53,25.66 39.76,26.42 v39.76,27.69 | v17.41,12.45 17.67,12.45 18.43,11.69 v19.7,11.69 | IC3.2 23.48,7.09 v23.76,7.37 | v28.33,7.63 v30.37,7.63
  Bottom 0.15: v33.16,7.12 33.16,6.61 33.92,5.85 v36.46,5.85 | v16.9,17.28 17.16,17.53 20.71,17.53 20.71,17.02 v21.98,17.02 | v24.27,23.37 24.52,23.63 29.1,23.63 29.6,23.12 30.37,23.12 31.13,22.36 31.13,22.1 v33.16,22.1 | v39.76,27.69 41.8,27.69 42.56,26.93 42.56,25.53 IC2.B2 | v19.7,11.69 21.22,11.69 21.22,10.42 23.76,7.88 v23.76,7.37 28.08,7.37 v28.33,7.63 | v30.37,7.63 30.87,8.13 v31.89,8.13
  other vias: 42.4,25.38
SWDCLK  (via drill 0.3, 0.35)
  Top 0.15: v33.67,14.99 33.46,15.2 U1.P$AA24 | v33.67,11.94 33.67,9.91 v32.91,9.15 | v19.19,4.83 18.71,4.83 TP_SWDCLK.TP | v6.49,5.85 6.37,5.85 J2.4
  Top 0.152: v0.9,6.86 v0.9,9.66 | v18.94,6.36 18.94,5.09 v19.19,4.83
  Bottom 0.15: v33.67,14.99 v33.67,11.94 | v32.91,9.15 32.91,8.39 29.86,5.34 29.86,4.83 v19.19,4.83 | v6.49,5.85 4.97,5.85 4.2,6.61 1.16,6.61 v0.9,6.86
  Bottom 0.152: v0.9,9.66 1.16,9.91 18.94,9.91 v18.94,6.36
SWDIO  (via drill 0.35)
  Top 0.15: J2.2 4.34,6.61 1.66,6.61 1.66,9.91 7.51,9.91 8.81,8.61 TP_SWDIO.TP 11.29,8.61 v12.08,9.4 | v32.91,14.23 32.91,14.43 U1.P$AC24 | v32.4,11.94 32.4,9.4 31.13,8.13 31.13,7.12 30.87,6.86 26.81,6.86 26.05,6.1 26.05,5.85 v21.22,5.85
  Bottom 0.15: v32.91,14.23 32.91,12.2 32.65,11.94 v32.4,11.94 | v21.22,5.85 16.65,5.85 16.65,9.4 v12.08,9.4
SWO
  Top 0.15: U1.P$AD22 31.64,13.21 | 31.64,13.21 31.64,12.71 35.72,12.71 TP_SWO.TP | 31.64,13.21
VBAT  (via drill 0.35)  (1 unrouted)
  Top 0.15: U3.2 U3.3
  Top 0.3: IC1.C2 37.19,7.48 37.45,7.23 37.62,7.23 C37.2 | TP_VBAT.TP 17.92,7.03 v17.92,6.36 | U3.3 13.48,10.67 v12.33,10.67 | v15.89,7.63 15.89,8.13 C27.2
  Route15 0.3: v15.89,7.63 15.89,7.37 16.9,6.36 v17.92,6.36 14.36,9.91 12.59,9.91 12.33,10.17 v12.33,10.67
VBUS  (via drill 0.35)
  Top 0.15: C42.1 26.28,31.34 26.54,31.09 28.75,31.09 28.84,31.18 C43.2 | D1.5 24.37,32.5 25.52,31.34 C42.1 | C42.1 25.47,31.34 24.88,30.76 24.88,28.87 J4.A4_B9 25.15,28.06 24.52,27.44 20.46,27.44 v19.95,26.93 20.35,27.32 J4.A9_B4 | IC1.A2 35.67,8.72 C38.2 36.23,9.89 v35.95,10.17 | U1.P$AD2 26.64,14.06 26.3,13.72 v26.3,13.47
  Top 0.3: C21.1 12.76,8.56 12.59,8.39 v12.33,8.39
  Route15 0.3: v26.3,13.47 26.43,13.34 | 26.43,13.34 27.06,12.71 34.94,12.71 35.95,11.69 v35.95,10.17 | 26.43,13.34 26.05,12.96 21.73,12.96 21.48,12.71 20.71,12.71 20.71,26.42 20.21,26.93 v19.95,26.93 17.92,26.93 17.92,17.28 10.81,10.17 10.81,8.64 11.06,8.39 v12.33,8.39
VREG  (via drill 0.35)
  Top 0.3: C23.1 39.26,8.19 39.26,9.38 C39.1 38.86,9.26 v38.24,8.64 | C23.1 42.06,8.3 C24.2 43.7,9.34 TP_VREG.TP | C23.1 40.55,6.82 IC9.A3 IC9.A2 IC9.A1 | v37.48,8.13 36.2,8.13 35.95,7.88 IC1.B2
  Route15 0.3: v38.24,8.64 38.11,8.77 v37.48,8.13